# EAGLE design edges_v01 (EAGLE 5.09)

## Sheet 1 of 3
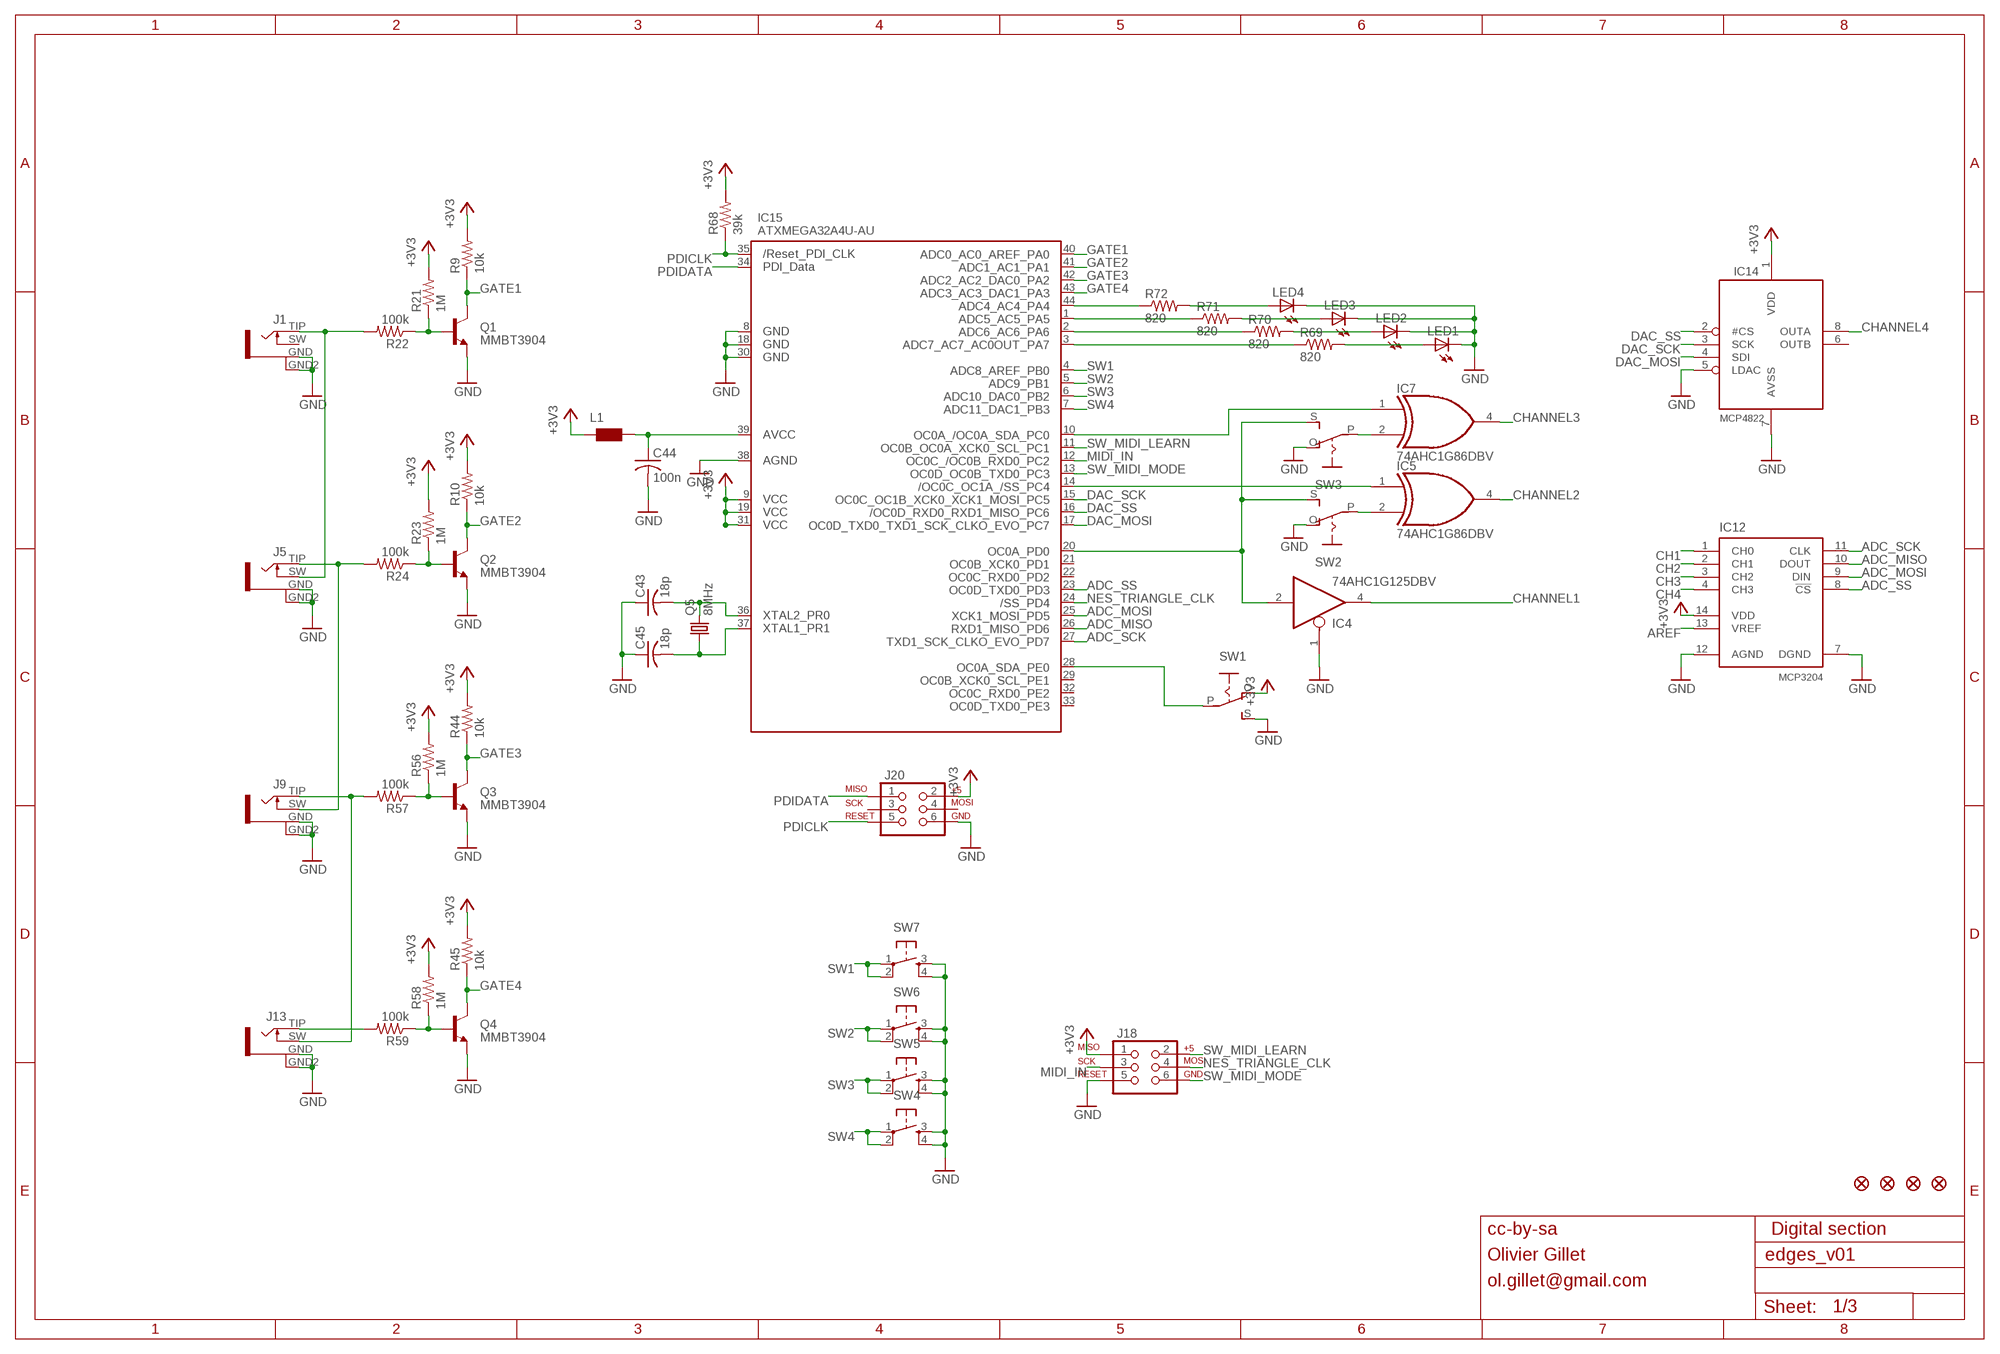
[diagram p0: schematic, sheet 1]

### Parts
C43  18p  C-USC0603  [C0603]
C44  100n  C-USC0603  [C0603]
C45  18p  C-USC0603  [C0603]
IC4  74AHC1G125DBV  [SOT23-5]
IC5  74AHC1G86DBV  [SOT23-5]
IC7  74AHC1G86DBV  [SOT23-5]
IC12  MCP3204  MCP3302  [SO14]
IC14  MCP4822  MCP4822SO08  [SO08]
IC15  ATXMEGA32A4U-AU  AVR_XMEGA_A4_44A  [TQFP44]
J1  PJ301WQP  [WQP_PJ_301BM]
J5  PJ301WQP  [WQP_PJ_301BM]
J9  PJ301WQP  [WQP_PJ_301BM]
J13  PJ301WQP  [WQP_PJ_301BM]
J18  AVR_SPI_PRG_6PTH  [2X3]
J20  AVR_SPI_PRG_6PTH  [2X3]
JP1  FIDUCIAL1X2  [FIDUCIAL-1X2]
JP2  FIDUCIAL1X2  [FIDUCIAL-1X2]
JP3  FIDUCIAL1X2  [FIDUCIAL-1X2]
JP4  FIDUCIAL1X2  [FIDUCIAL-1X2]
L1  WE-CBF_0603  [0603]
LED1  LED3MM  [LED3MM]
LED2  LED3MM  [LED3MM]
LED3  LED3MM  [LED3MM]
LED4  LED3MM  [LED3MM]
Q1  MMBT3904  MMBT3904LT1-NPN-SOT23-BEC  [SOT23-BEC]
Q2  MMBT3904  MMBT3904LT1-NPN-SOT23-BEC  [SOT23-BEC]
Q3  MMBT3904  MMBT3904LT1-NPN-SOT23-BEC  [SOT23-BEC]
Q4  MMBT3904  MMBT3904LT1-NPN-SOT23-BEC  [SOT23-BEC]
Q5  8MHz  CRYSTALHC49U70  [HC49U70]
R9  10k  R-US_R0603  [R0603]
R10  10k  R-US_R0603  [R0603]
R21  1M  R-US_R0603  [R0603]
R22  100k  R-US_R0603  [R0603]
R23  1M  R-US_R0603  [R0603]
R24  100k  R-US_R0603  [R0603]
R44  10k  R-US_R0603  [R0603]
R45  10k  R-US_R0603  [R0603]
R56  1M  R-US_R0603  [R0603]
R57  100k  R-US_R0603  [R0603]
R58  1M  R-US_R0603  [R0603]
R59  100k  R-US_R0603  [R0603]
R68  39k  R-US_R0603  [R0603]
R69  820  R-US_R0603  [R0603]
R70  820  R-US_R0603  [R0603]
R71  820  R-US_R0603  [R0603]
R72  820  R-US_R0603  [R0603]
SW1  S-ON-ONSMALL_SLIDE  [ES_100SP1T6B11M2QEH_SMALL]
SW2  S-ON-ONSMALL_SLIDE  [ES_100SP1T6B11M2QEH_SMALL]
SW3  S-ON-ONSMALL_SLIDE  [ES_100SP1T6B11M2QEH_SMALL]
SW4  TAC_SWITCHPTH  [TACTILE-PTH]
SW5  TAC_SWITCHPTH  [TACTILE-PTH]
SW6  TAC_SWITCHPTH  [TACTILE-PTH]
SW7  TAC_SWITCHPTH  [TACTILE-PTH]

### Nets
+3V3: IC12.14(VDD) IC14.1(VDD) IC15.9(VCC1) IC15.19(VCC2) IC15.31(VCC3) J18.1 J20.2 L1.1 R9.2 R10.2 R21.2 R23.2 R44.2 R45.2 R56.2 R58.2 R68.2 SW1.O ; also sheet 3
ADC_MISO: IC12.10(DOUT) IC15.26(PD6)
ADC_MOSI: IC12.9(DIN) IC15.25(PD5)
ADC_SCK: IC12.11(CLK) IC15.27(PD7)
ADC_SS: IC12.8(!CS) IC15.23(PD3)
AREF: IC12.13(VREF) ; also sheet 3
CH1: IC12.1(CH0) ; also sheet 2
CH2: IC12.2(CH1) ; also sheet 2
CH3: IC12.3(CH2) ; also sheet 2
CH4: IC12.4(CH3) ; also sheet 2
CHANNEL1: IC4.4(O) ; also sheet 2
CHANNEL2: IC5.4(O) ; also sheet 2
CHANNEL3: IC7.4(O) ; also sheet 2
CHANNEL4: IC14.8(OUTA) ; also sheet 2
DAC_MOSI: IC14.4(SDI) IC15.17(PC7)
DAC_SCK: IC14.3(SCK) IC15.15(PC5)
DAC_SS: IC14.2(#CS) IC15.16(PC6)
GATE1: IC15.40(PA0) Q1.C R9.1
GATE1_IN: J1.TIP J5.SW R22.2
GATE1_LED: LED4.A R72.2
GATE2: IC15.41(PA1) Q2.C R10.1
GATE2_IN: J5.TIP J9.SW R24.2
GATE2_LED: LED3.A R71.2
GATE3: IC15.42(PA2) Q3.C R44.1
GATE3_IN: J9.TIP J13.SW R57.2
GATE3_LED: LED2.A R70.2
GATE4: IC15.43(PA3) Q4.C R45.1
GATE4_IN: J13.TIP R59.2
GATE4_LED: LED1.A R69.2
GND: C43.1 C44.2 C45.1 IC4.1(OE) IC12.7(DGND) IC12.12(AGND) IC14.5(LDAC) IC14.7(AVSS) IC15.8(GND1) IC15.18(GND2) IC15.30(GND3) IC15.38(AGND) J1.GND J1.GND2 J5.GND J5.GND2 J9.GND J9.GND2 J13.GND J13.GND2 J18.5 J20.6 LED1.K(C) LED2.K(C) LED3.K(C) LED4.K(C) Q1.E Q2.E Q3.E Q4.E SW1.S SW2.O SW3.O SW4.3 SW4.4 SW5.3 SW5.4 SW6.3 SW6.4 SW7.3 SW7.4 ; also sheet 2,3
MIDI_IN: IC15.12(PC2) J18.3
N$1: Q1.B R21.1 R22.1
N$2: Q2.B R23.1 R24.1
N$3: Q3.B R56.1 R57.1
N$5: IC15.44(PA4) R72.1
N$6: IC15.1(PA5) R71.1
N$7: IC15.2(PA6) R70.1
N$8: IC15.3(PA7) R69.1
N$19: IC5.1(I0) IC15.14(PC4)
N$21: IC7.2(I1) SW3.P
N$24: IC5.2(I1) SW2.P
N$39: C44.1 IC15.39(AVCC) L1.2
N$41: IC7.1(I0) IC15.10(PC0)
N$48: IC4.2(I) IC15.20(PD0) SW2.S SW3.S
N$82: C45.2 IC15.37(PR1) Q5.1
N$83: C43.2 IC15.36(PR0) Q5.2
N$40000: Q4.B R58.1 R59.1
NES_TRIANGLE_CLK: IC15.24(PD4) J18.4
PDICLK: IC15.35(RESET) J20.5 R68.1
PDIDATA: IC15.34(PDI_DATA) J20.1
SW1: IC15.4(PB0) SW7.1 SW7.2
SW2: IC15.5(PB1) SW6.1 SW6.2
SW3: IC15.6(PB2) SW5.1 SW5.2
SW4: IC15.7(PB3) SW4.1 SW4.2
SW_MIDI_LEARN: IC15.11(PC1) J18.2
SW_MIDI_MODE: IC15.13(PC3) J18.6
SYNC_SWITCH: IC15.28(PE0) SW1.P
Unconnected: IC14.6(OUTB) IC15.21(PD1) IC15.22(PD2) IC15.29(PE1) IC15.32(PE2) IC15.33(PE3) J1.SW J20.3 J20.4

### Notes on the sheet
- cc-by-sa | Digital section
- Olivier Gillet
- ol.gillet@gmail.com

## Sheet 2 of 3
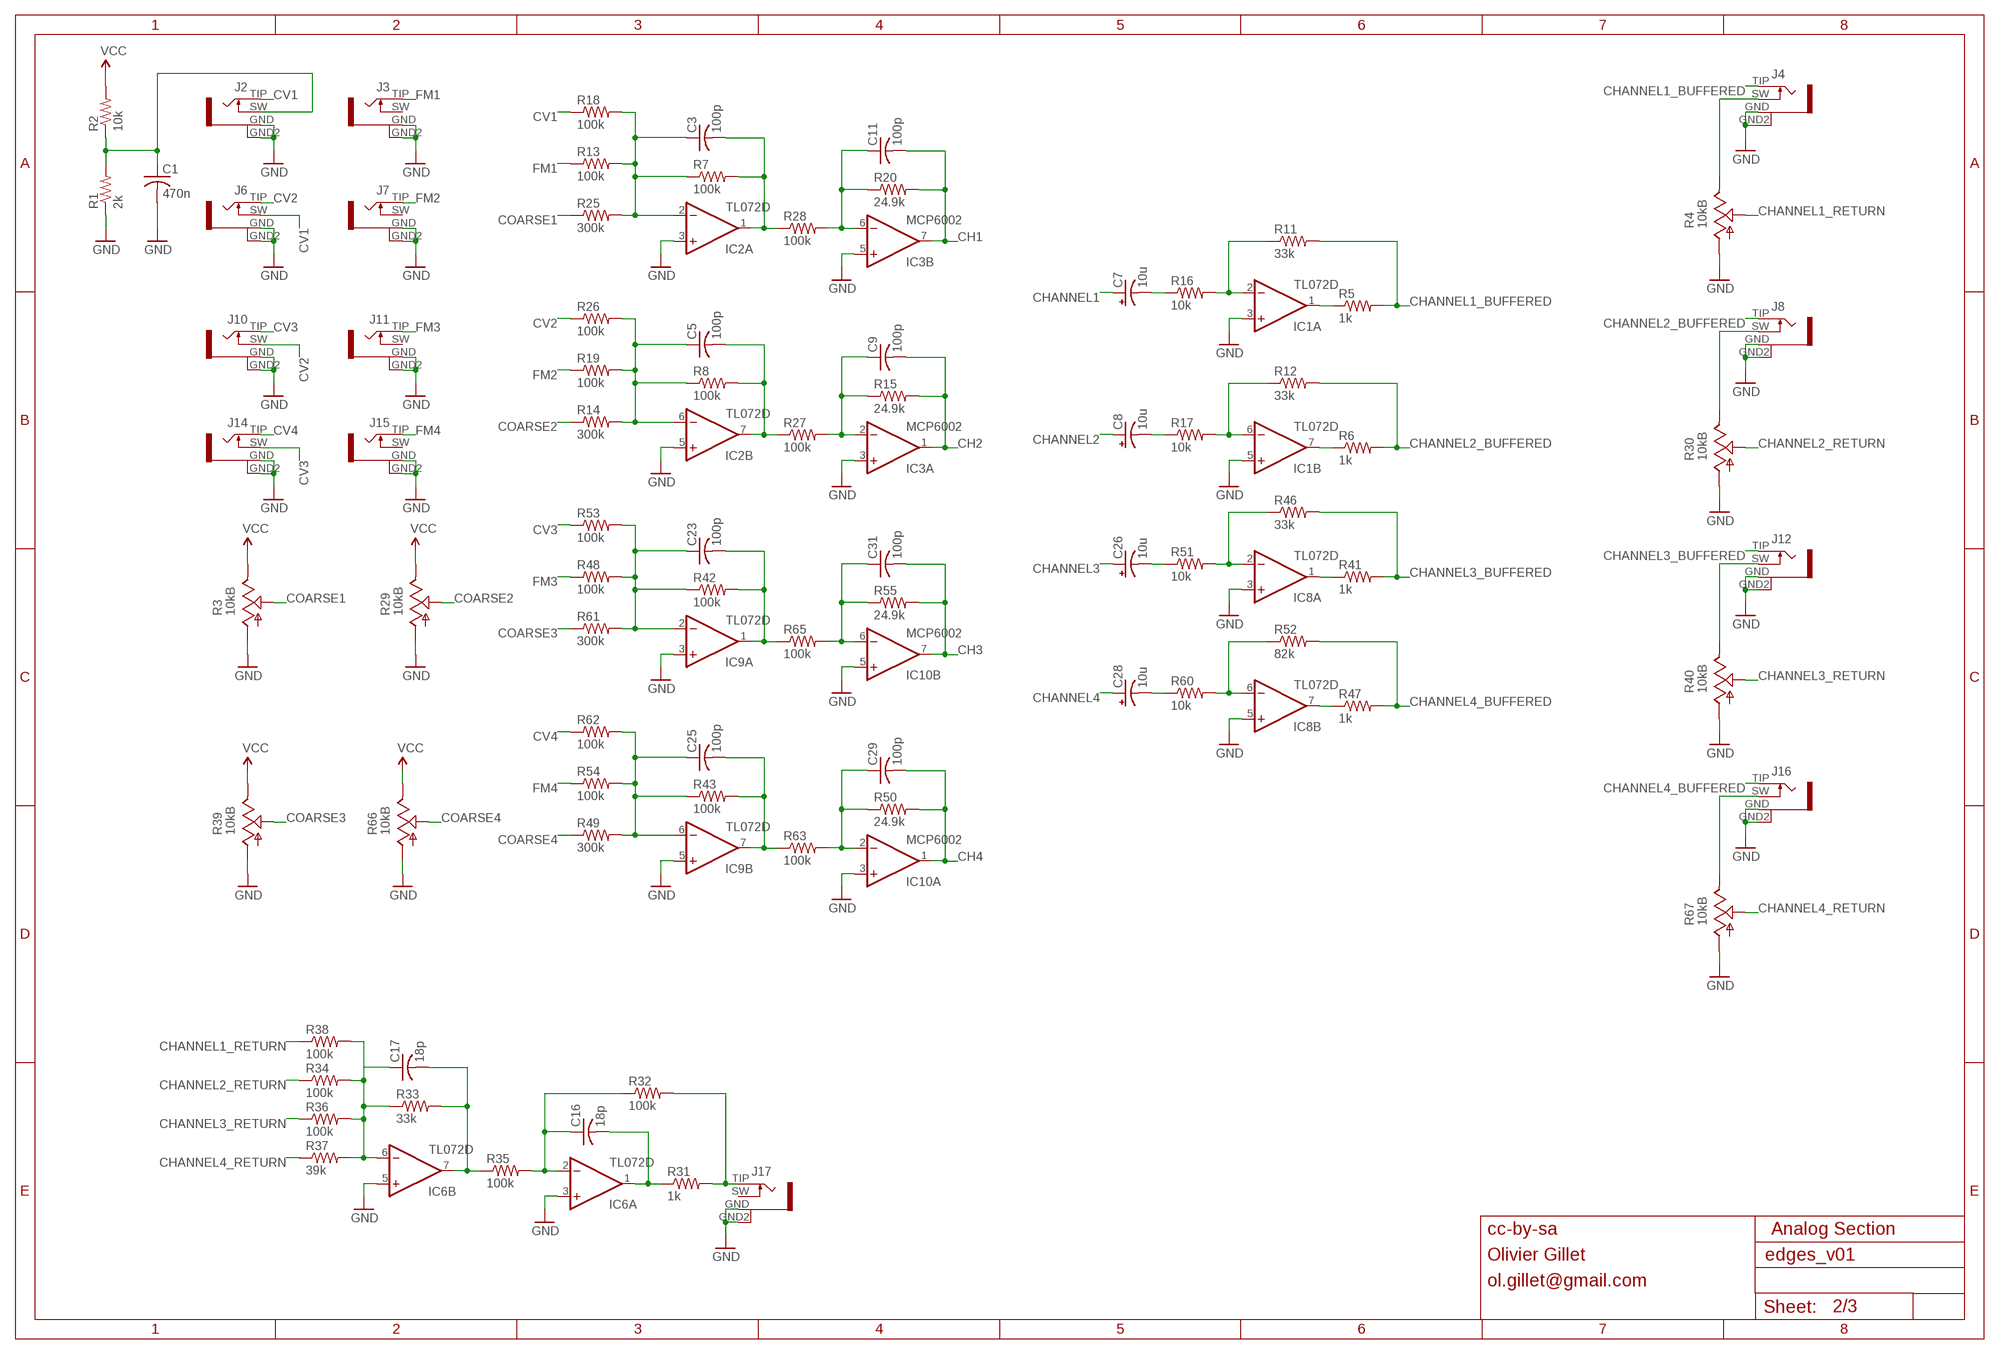
[diagram p1: schematic, sheet 2]

### Parts
C1  470n  C-USC0603  [C0603]
C3  100p  C-USC0603  [C0603]
C5  100p  C-USC0603  [C0603]
C7  10u  CPOL-USC  [PANASONIC_C]
C8  10u  CPOL-USC  [PANASONIC_C]
C9  100p  C-USC0603  [C0603]
C11  100p  C-USC0603  [C0603]
C16  18p  C-USC0603  [C0603]
C17  18p  C-USC0603  [C0603]
C23  100p  C-USC0603  [C0603]
C25  100p  C-USC0603  [C0603]
C26  10u  CPOL-USC  [PANASONIC_C]
C28  10u  CPOL-USC  [PANASONIC_C]
C29  100p  C-USC0603  [C0603]
C31  100p  C-USC0603  [C0603]
IC1  TL072D  [SO08]
IC2  TL072D  [SO08]
IC3  MCP6002  TL072D  [SO08]
IC6  TL072D  [SO08]
IC8  TL072D  [SO08]
IC9  TL072D  [SO08]
IC10  MCP6002  TL072D  [SO08]
J2  PJ301WQP  [WQP_PJ_301BM]
J3  PJ301WQP  [WQP_PJ_301BM]
J4  PJ301WQP  [WQP_PJ_301BM]
J6  PJ301WQP  [WQP_PJ_301BM]
J7  PJ301WQP  [WQP_PJ_301BM]
J8  PJ301WQP  [WQP_PJ_301BM]
J10  PJ301WQP  [WQP_PJ_301BM]
J11  PJ301WQP  [WQP_PJ_301BM]
J12  PJ301WQP  [WQP_PJ_301BM]
J14  PJ301WQP  [WQP_PJ_301BM]
J15  PJ301WQP  [WQP_PJ_301BM]
J16  PJ301WQP  [WQP_PJ_301BM]
J17  PJ301WQP  [WQP_PJ_301BM]
R1  2k  R-US_R0603  [R0603]
R2  10k  R-US_R0603  [R0603]
R3  10kB  POT_USVERTICAL_PS  [ALPS_POT_VERTICAL_PS]
R4  10kB  POT_USVERTICAL_PS  [ALPS_POT_VERTICAL_PS]
R5  1k  R-US_R0603  [R0603]
R6  1k  R-US_R0603  [R0603]
R7  100k  R-US_R0603  [R0603]
R8  100k  R-US_R0603  [R0603]
R11  33k  R-US_R0603  [R0603]
R12  33k  R-US_R0603  [R0603]
R13  100k  R-US_R0603  [R0603]
R14  300k  R-US_R0603  [R0603]
R15  24.9k  R-US_R0603  [R0603]
R16  10k  R-US_R0603  [R0603]
R17  10k  R-US_R0603  [R0603]
R18  100k  R-US_R0603  [R0603]
R19  100k  R-US_R0603  [R0603]
R20  24.9k  R-US_R0603  [R0603]
R25  300k  R-US_R0603  [R0603]
R26  100k  R-US_R0603  [R0603]
R27  100k  R-US_R0603  [R0603]
R28  100k  R-US_R0603  [R0603]
R29  10kB  POT_USVERTICAL_PS  [ALPS_POT_VERTICAL_PS]
R30  10kB  POT_USVERTICAL_PS  [ALPS_POT_VERTICAL_PS]
R31  1k  R-US_R0603  [R0603]
R32  100k  R-US_R0603  [R0603]
R33  33k  R-US_R0603  [R0603]
R34  100k  R-US_R0603  [R0603]
R35  100k  R-US_R0603  [R0603]
R36  100k  R-US_R0603  [R0603]
R37  39k  R-US_R0603  [R0603]
R38  100k  R-US_R0603  [R0603]
R39  10kB  POT_USVERTICAL_PS  [ALPS_POT_VERTICAL_PS]
R40  10kB  POT_USVERTICAL_PS  [ALPS_POT_VERTICAL_PS]
R41  1k  R-US_R0603  [R0603]
R42  100k  R-US_R0603  [R0603]
R43  100k  R-US_R0603  [R0603]
R46  33k  R-US_R0603  [R0603]
R47  1k  R-US_R0603  [R0603]
R48  100k  R-US_R0603  [R0603]
R49  300k  R-US_R0603  [R0603]
R50  24.9k  R-US_R0603  [R0603]
R51  10k  R-US_R0603  [R0603]
R52  82k  R-US_R0603  [R0603]
R53  100k  R-US_R0603  [R0603]
R54  100k  R-US_R0603  [R0603]
R55  24.9k  R-US_R0603  [R0603]
R60  10k  R-US_R0603  [R0603]
R61  300k  R-US_R0603  [R0603]
R62  100k  R-US_R0603  [R0603]
R63  100k  R-US_R0603  [R0603]
R65  100k  R-US_R0603  [R0603]
R66  10kB  POT_USVERTICAL_PS  [ALPS_POT_VERTICAL_PS]
R67  10kB  POT_USVERTICAL_PS  [ALPS_POT_VERTICAL_PS]

### Nets
CH1: C11.2 IC3.7(B:OUT) R20.2 ; also sheet 1
CH2: C9.2 IC3.1(A:OUT) R15.2 ; also sheet 1
CH3: C31.2 IC10.7(B:OUT) R55.2 ; also sheet 1
CH4: C29.2 IC10.1(A:OUT) R50.2 ; also sheet 1
CHANNEL1: C7.+ ; also sheet 1
CHANNEL1_BUFFERED: J4.TIP R5.2 R11.2
CHANNEL1_RETURN: R4.P$2(S) R38.1
CHANNEL2: C8.+ ; also sheet 1
CHANNEL2_BUFFERED: J8.TIP R6.2 R12.2
CHANNEL2_RETURN: R30.P$2(S) R34.1
CHANNEL3: C26.+ ; also sheet 1
CHANNEL3_BUFFERED: J12.TIP R41.2 R46.2
CHANNEL3_RETURN: R36.1 R40.P$2(S)
CHANNEL4: C28.+ ; also sheet 1
CHANNEL4_BUFFERED: J16.TIP R47.2 R52.2
CHANNEL4_RETURN: R37.1 R67.P$2(S)
COARSE1: R3.P$2(S) R25.1
COARSE2: R14.1 R29.P$2(S)
COARSE3: R39.P$2(S) R61.1
COARSE4: R49.1 R66.P$2(S)
CV1: J2.TIP J6.SW R18.1
CV2: J6.TIP J10.SW R26.1
CV3: J10.TIP J14.SW R53.1
CV4: J14.TIP R62.1
FM1: J3.TIP R13.1
FM2: J7.TIP R19.1
FM3: J11.TIP R48.1
FM4: J15.TIP R54.1
GND: C1.2 IC1.3(A:+IN) IC1.5(B:+IN) IC2.3(A:+IN) IC2.5(B:+IN) IC3.3(A:+IN) IC3.5(B:+IN) IC6.3(A:+IN) IC6.5(B:+IN) IC8.3(A:+IN) IC8.5(B:+IN) IC9.3(A:+IN) IC9.5(B:+IN) IC10.3(A:+IN) IC10.5(B:+IN) J2.GND J2.GND2 J3.GND J3.GND2 J4.GND J4.GND2 J6.GND J6.GND2 J7.GND J7.GND2 J8.GND J8.GND2 J10.GND J10.GND2 J11.GND J11.GND2 J12.GND J12.GND2 J14.GND J14.GND2 J15.GND J15.GND2 J16.GND J16.GND2 J17.GND J17.GND2 R1.1 R3.P$3(A) R4.P$3(A) R29.P$3(A) R30.P$3(A) R39.P$3(A) R40.P$3(A) R66.P$3(A) R67.P$3(A) ; also sheet 1,3
N$4: J8.SW R30.P$1(E)
N$9: C5.1 IC2.6(B:-IN) R8.1 R14.2 R19.2 R26.2
N$10: C5.2 IC2.7(B:OUT) R8.2 R27.1
N$11: C9.1 IC3.2(A:-IN) R15.1 R27.2
N$12: C3.2 IC2.1(A:OUT) R7.2 R28.1
N$13: C23.1 IC9.2(A:-IN) R42.1 R48.2 R53.2 R61.2
N$14: C23.2 IC9.1(A:OUT) R42.2 R65.1
N$15: C31.1 IC10.6(B:-IN) R55.1 R65.2
N$16: C25.1 IC9.6(B:-IN) R43.1 R49.2 R54.2 R62.2
N$17: C25.2 IC9.7(B:OUT) R43.2 R63.1
N$18: C29.1 IC10.2(A:-IN) R50.1 R63.2
N$20: C7.- R16.1
N$22: IC1.2(A:-IN) R11.1 R16.2
N$23: IC1.1(A:OUT) R5.1
N$25: C8.- R17.1
N$26: IC1.6(B:-IN) R12.1 R17.2
N$27: IC1.7(B:OUT) R6.1
N$28: C26.- R51.1
N$29: C11.1 IC3.6(B:-IN) R20.1 R28.2
N$30: IC8.2(A:-IN) R46.1 R51.2
N$31: IC8.1(A:OUT) R41.1
N$32: C28.- R60.1
N$33: IC8.6(B:-IN) R52.1 R60.2
N$34: IC8.7(B:OUT) R47.1
N$35: C17.1 IC6.6(B:-IN) R33.1 R34.2 R36.2 R37.2 R38.2
N$36: C16.1 IC6.2(A:-IN) R32.1 R35.2
N$37: C16.2 IC6.1(A:OUT) R31.1
N$40: J4.SW R4.P$1(E)
N$42: C17.2 IC6.7(B:OUT) R33.2 R35.1
N$43: J12.SW R40.P$1(E)
N$44: J16.SW R67.P$1(E)
N$45: C3.1 IC2.2(A:-IN) R7.1 R13.2 R18.2 R25.2
N$46: C1.1 J2.SW R1.2 R2.1
N$50: J17.TIP R31.2 R32.2
VCC: R2.2 R3.P$1(E) R29.P$1(E) R39.P$1(E) R66.P$1(E) ; also sheet 3
Unconnected: J3.SW J7.SW J11.SW J15.SW J17.SW

### Notes on the sheet
- cc-by-sa | Analog Section
- Olivier Gillet
- ol.gillet@gmail.com

## Sheet 3 of 3
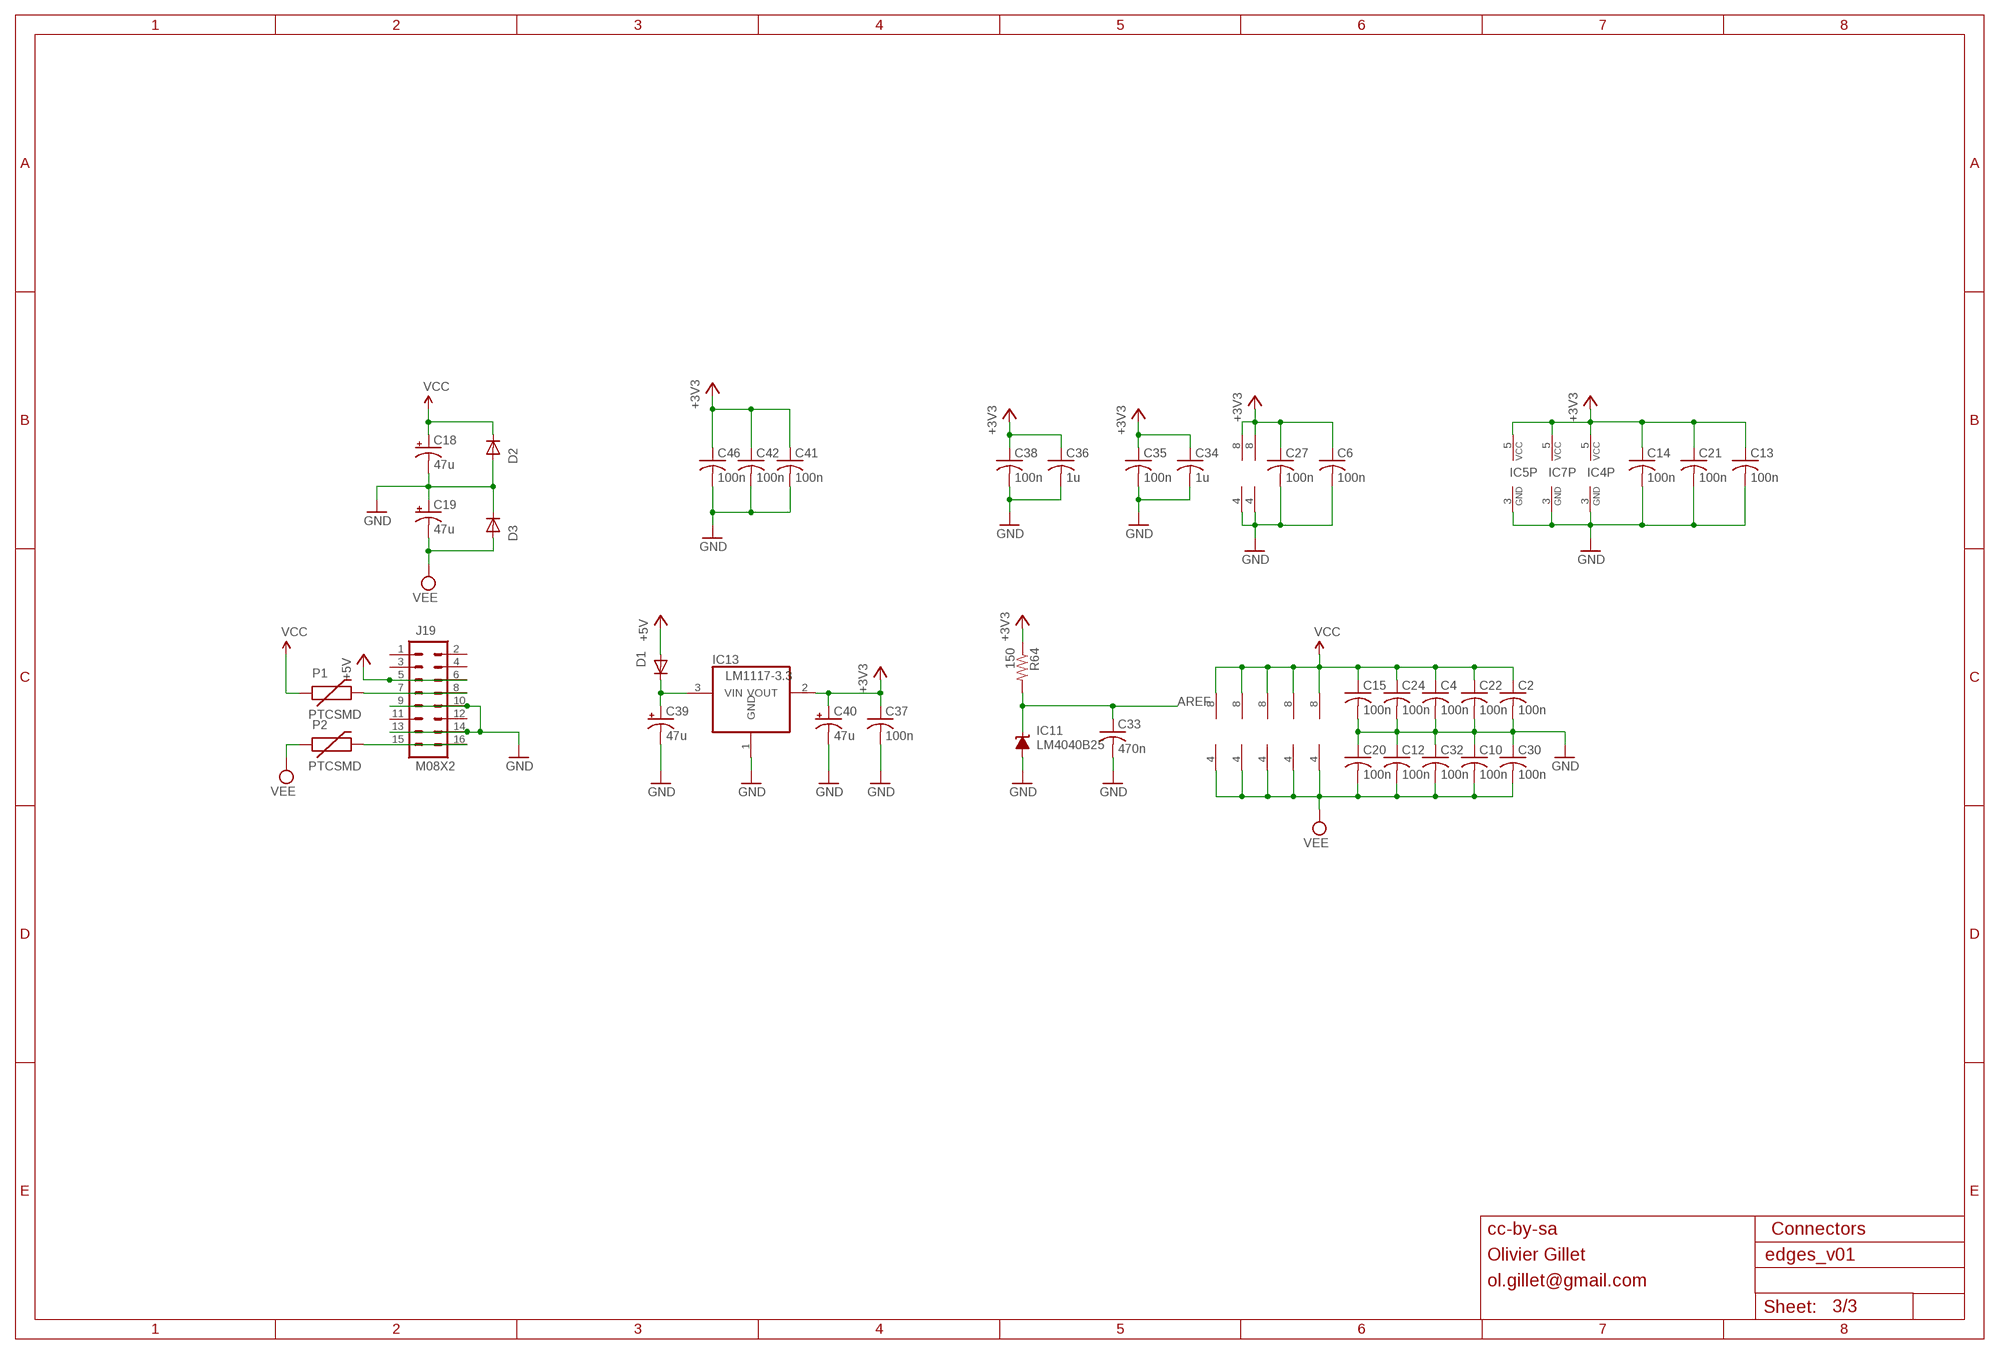
[diagram p2: schematic, sheet 3]

### Parts
C2  100n  C-USC0603  [C0603]
C4  100n  C-USC0603  [C0603]
C6  100n  C-USC0603  [C0603]
C10  100n  C-USC0603  [C0603]
C12  100n  C-USC0603  [C0603]
C13  100n  C-USC0603  [C0603]
C14  100n  C-USC0603  [C0603]
C15  100n  C-USC0603  [C0603]
C18  47u  CPOL-USD  [PANASONIC_D]
C19  47u  CPOL-USD  [PANASONIC_D]
C20  100n  C-USC0603  [C0603]
C21  100n  C-USC0603  [C0603]
C22  100n  C-USC0603  [C0603]
C24  100n  C-USC0603  [C0603]
C27  100n  C-USC0603  [C0603]
C30  100n  C-USC0603  [C0603]
C32  100n  C-USC0603  [C0603]
C33  470n  C-USC0603  [C0603]
C34  1u  C-USC0603  [C0603]
C35  100n  C-USC0603  [C0603]
C36  1u  C-USC0603  [C0603]
C37  100n  C-USC0603  [C0603]
C38  100n  C-USC0603  [C0603]
C39  47u  CPOL-USD  [PANASONIC_D]
C40  47u  CPOL-USD  [PANASONIC_D]
C41  100n  C-USC0603  [C0603]
C42  100n  C-USC0603  [C0603]
C46  100n  C-USC0603  [C0603]
D1  1N5819HW  DIODE-SOD123  [SOD123]
D2  1N5819HW  DIODE-SOD123  [SOD123]
D3  1N5819HW  DIODE-SOD123  [SOD123]
IC11  LM4040B25  LM4041B12DBZ  [DBZ_R-PDSO-G3]
IC13  LM1117-3.3  REG1117  [SOT223]
J19  M08X2  [2X8]
P1  PTCSMD  [PTC-1206]
P2  PTCSMD  [PTC-1206]
R64  150  R-US_R0603  [R0603]

### Nets
+3V3: C6.1 C13.1 C14.1 C21.1 C27.1 C34.1 C35.1 C36.1 C37.1 C38.1 C40.+ C41.1 C42.1 C46.1 IC3.8(P:V+) IC4.5(VCC) IC5.5(VCC) IC7.5(VCC) IC10.8(P:V+) IC13.2(VOUT) R64.1 ; also sheet 1
+5V: D1.A J19.5 J19.6
AREF: C33.1 IC11.1(C) R64.2 ; also sheet 1
GND: C2.2 C4.2 C6.2 C10.1 C12.1 C13.2 C14.2 C15.2 C18.- C19.+ C20.1 C21.2 C22.2 C24.2 C27.2 C30.1 C32.1 C33.2 C34.2 C35.2 C36.2 C37.2 C38.2 C39.- C40.- C41.2 C42.2 C46.2 D2.A D3.C IC3.4(P:V-) IC4.3(GND) IC5.3(GND) IC7.3(GND) IC10.4(P:V-) IC11.2(A) IC13.1(GND) J19.9 J19.10 J19.13 J19.14 ; also sheet 1,2
N$38: C39.+ D1.C IC13.3(VIN)
N$47: J19.7 J19.8 P1.2
N$49: J19.15 J19.16 P2.2
VCC: C2.1 C4.1 C15.1 C18.+ C22.1 C24.1 D2.C IC1.8(P:V+) IC2.8(P:V+) IC6.8(P:V+) IC8.8(P:V+) IC9.8(P:V+) P1.1 ; also sheet 2
VEE: C10.2 C12.2 C19.- C20.2 C30.2 C32.2 D3.A IC1.4(P:V-) IC2.4(P:V-) IC6.4(P:V-) IC8.4(P:V-) IC9.4(P:V-) P2.1
Unconnected: J19.1 J19.2 J19.3 J19.4 J19.11 J19.12

### Notes on the sheet
- cc-by-sa | Connectors
- Olivier Gillet
- ol.gillet@gmail.com

## Library data of the parts
C1-C6 C9-C17 C20-C25 C27 C29-C38 C41-C46 = rcl:C-US: CAPACITOR, American symbol
C7 C8 C18 C19 C26 C28 C39 C40 = rcl:CPOL-US: POLARIZED CAPACITOR, American symbol
D1-D3 = diode:DIODE-: DIODE
IC1-IC3 IC6 IC8-IC10 = og-linear:TL072: OP AMP
IC4 = 74xx-little-us:74*1G125: Single Bus Buffer Gate with 3-State Output
IC5 IC7 = 74xx-little-us:74*1G86: 2-input EXCLUSIV-OR gate
IC11 = texas:LM4041: PRECISION MICROPOWER SHUNT VOLTAGE REFERENCE Source: http://focus.ti.com/lit/ds/slcs146e/slcs146e.pdf
IC12 = og-adc:MCP3302
IC13 = og-vreg:REG1117: 800mA and 1A Low Dropout (LDO) Positive Regulator 1.8V, 2.5V, 2.85V, 3.3V, 5V, and Adj
IC14 = og-dac:MCP4822
IC15 = xmega:AVR_XMEGA_A4_: Device for Atmel AVR XMEGA A4 Series
J1-J17 = og-pj301:PJ301
J18 J20 = SparkFun:AVR_SPI_PRG_6: AVR ISP 6 Pin This is the reduced ISP connector for AVR programming. Common on Arduino. This footprint will take up less PCB space and can be used with a 10-pin to 6-pin adapter such as SKU: BOB-08508
J19 = og-header:M08X2
JP1-JP4 = SparkFun:FIDUCIAL: Fiducial Alignment Points Various fiducial points for machine vision alignment.
L1 = wuerth-elektronik:WE-CBF: SMD EMI Suppression Ferrite Beads - excellent anti-EMI properties - low DCR - impedances till 3000 ohms - rated current up to 6 A
LED1-LED4 = led:LED: LED OSRAM: - CHIPLED LG R971, LG N971, LY N971, LG Q971, LY Q971, LO R971, LY R971 LH N974, LH R974 LS Q976, LO Q976, LY Q976 LO Q996 - Hyper CHIPLED LW Q18S LB Q993, LB Q99A, LB R99A - SideLED LS A670, LO A670, LY A670, LG A670, LP A670 LB A673, LV A673, LT A673, LW A673 LH A674 LY A675 LS A676, LA A676, LO A676, LY A676, LW A676 LS A679, LY A679, LG A679 - Hyper Micro SIDELED® LS Y876, LA Y876, LO Y876, LY Y876 LT Y87S - SmartLED LW L88C, LW L88S LB L89C, LB L89S, LG L890 LS L89K, LO L89K, LY L89K LS L896, LA L896, LO L896, LY L896 - TOPLED LS T670, LO T670, LY T670, LG T670, LP T670 LSG T670, LSP T670, LSY T670, LOP T670, LYG T670 LG T671, LOG T671, LSG T671 LB T673, LV T673, LT T673, LW T673 LH T674 LS T676, LA T676, LO T676, LY T676, LB T676, LH T676, LSB T676, LW T676 LB T67C, LV T67C, LT T67C, LS T67K, LO T67K, LY T67K, LW E67C LS E67B, LA E67B, LO E67B, LY E67B, LB E67C, LV E67C, LT E67C LW T67C LS T679, LY T679, LG T679 LS T770, LO T770, LY T770, LG T770, LP T770 LB T773, LV T773, LT T773, LW T773 LH T774 LS E675, LA E675, LY E675, LS T675 LS T776, LA T776, LO T776, LY T776, LB T776 LHGB T686 LT T68C, LB T68C - Hyper Mini TOPLED® LB M676 - Mini TOPLED Santana® LG M470 LS M47K, LO M47K, LY M47K Source: http://www.osram.convergy.de LUXEON: - LUMILED® LXK2-PW12-R00, LXK2-PW12-S00, LXK2-PW14-U00, LXK2-PW14-V00 LXK2-PM12-R00, LXK2-PM12-S00, LXK2-PM14-U00 LXK2-PE12-Q00, LXK2-PE12-R00, LXK2-PE12-S00, LXK2-PE14-T00, LXK2-PE14-U00 LXK2-PB12-K00, LXK2-PB12-L00, LXK2-PB12-M00, LXK2-PB14-N00, LXK2-PB14-P00, LXK2-PB14-Q00 LXK2-PR12-L00, LXK2-PR12-M00, LXK2-PR14-Q00, LXK2-PR14-R00 LXK2-PD12-Q00, LXK2-PD12-R00, LXK2-PD12-S00 LXK2-PH12-R00, LXK2-PH12-S00 LXK2-PL12-P00, LXK2-PL12-Q00, LXK2-PL12-R00 Source: www.luxeon.com KINGBRIGHT: KA-3528ASYC Source: www.kingbright.com
P1 P2 = SparkFun:PTC: Resettable Fuse PTC Resettable Fuse. Spark Fun Electronics SKU : COM-08357
Q1-Q4 = transistor:*-NPN-: NPN Transistror BF959 corrected 2008.03.06
Q5 = crystal:CRYSTAL: CRYSTAL
R1 R2 R5-R28 R31-R38 R41-R65 R68-R72 = rcl:R-US_: RESISTOR, American symbol
R3 R4 R29 R30 R39 R40 R66 R67 = pot-alps:POT_US
SW1-SW3 = og-switch:S-ON-ON: On-on Switch
SW4-SW7 = SparkFun:TAC_SWITCH: Momentary Switch Button commonly used for reset or general input. Spark Fun Electronics SKU : COM-00097

## Board
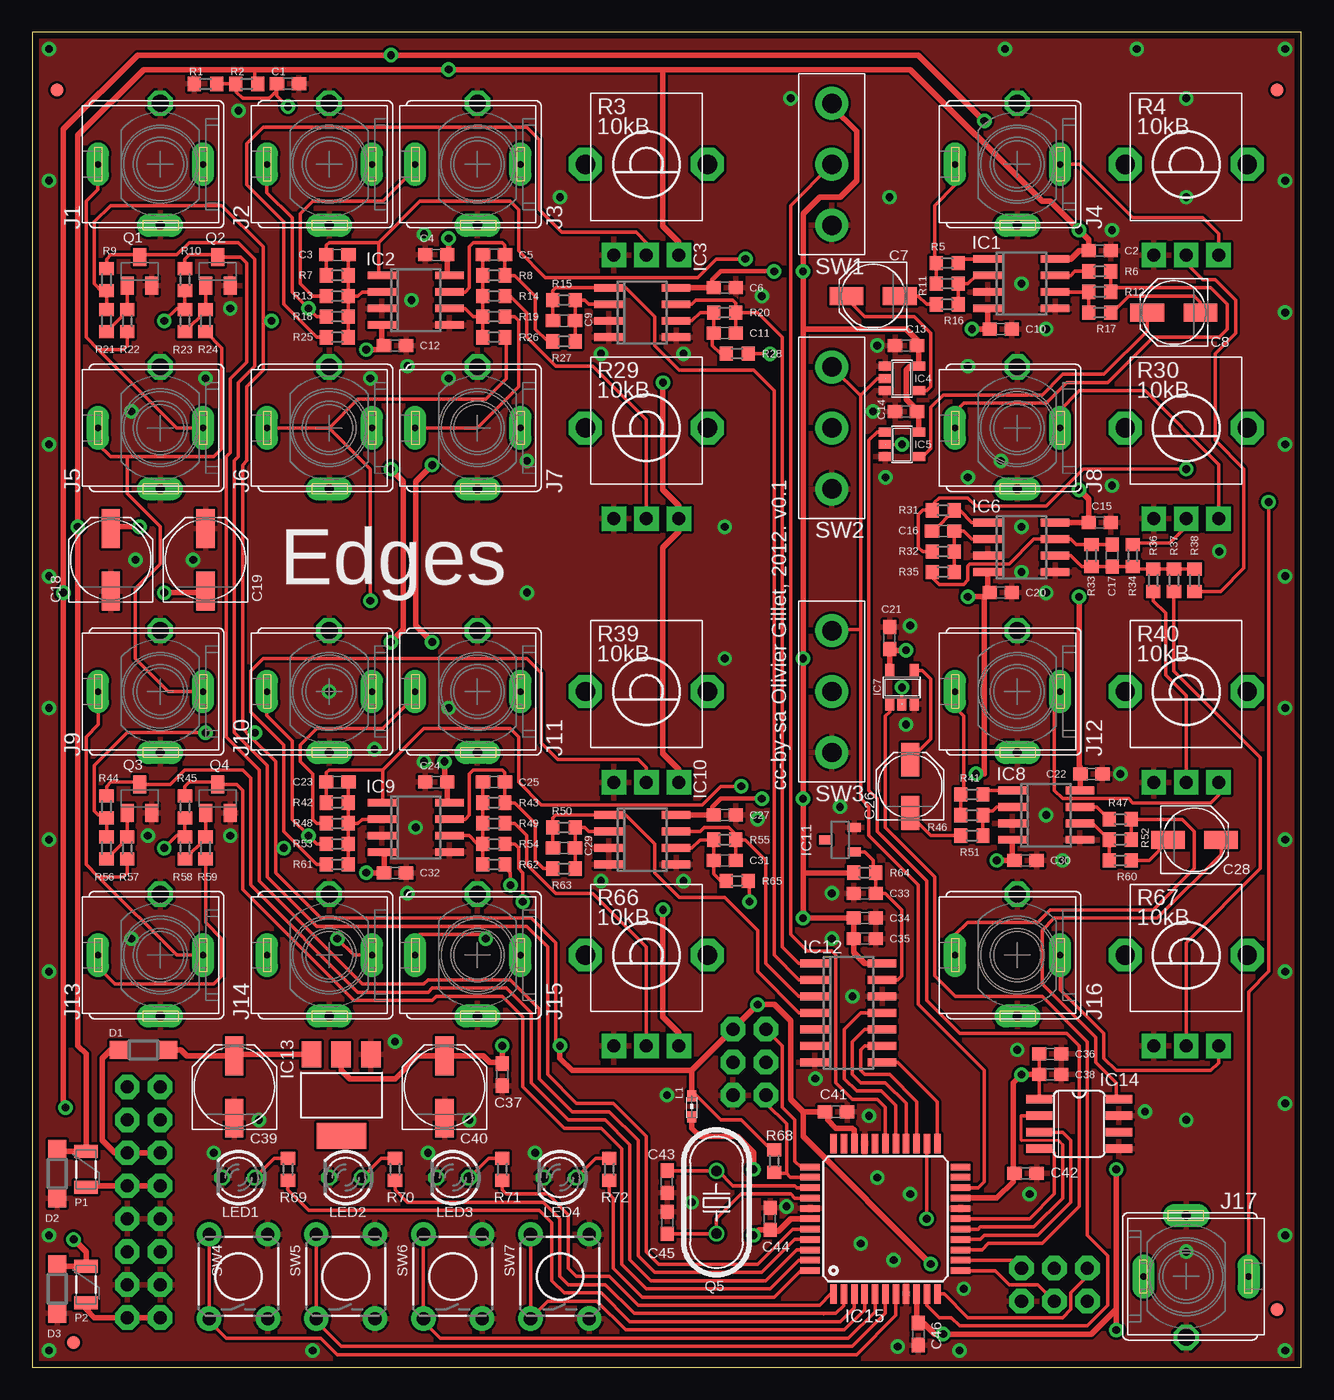
[diagram p3: board, top side]
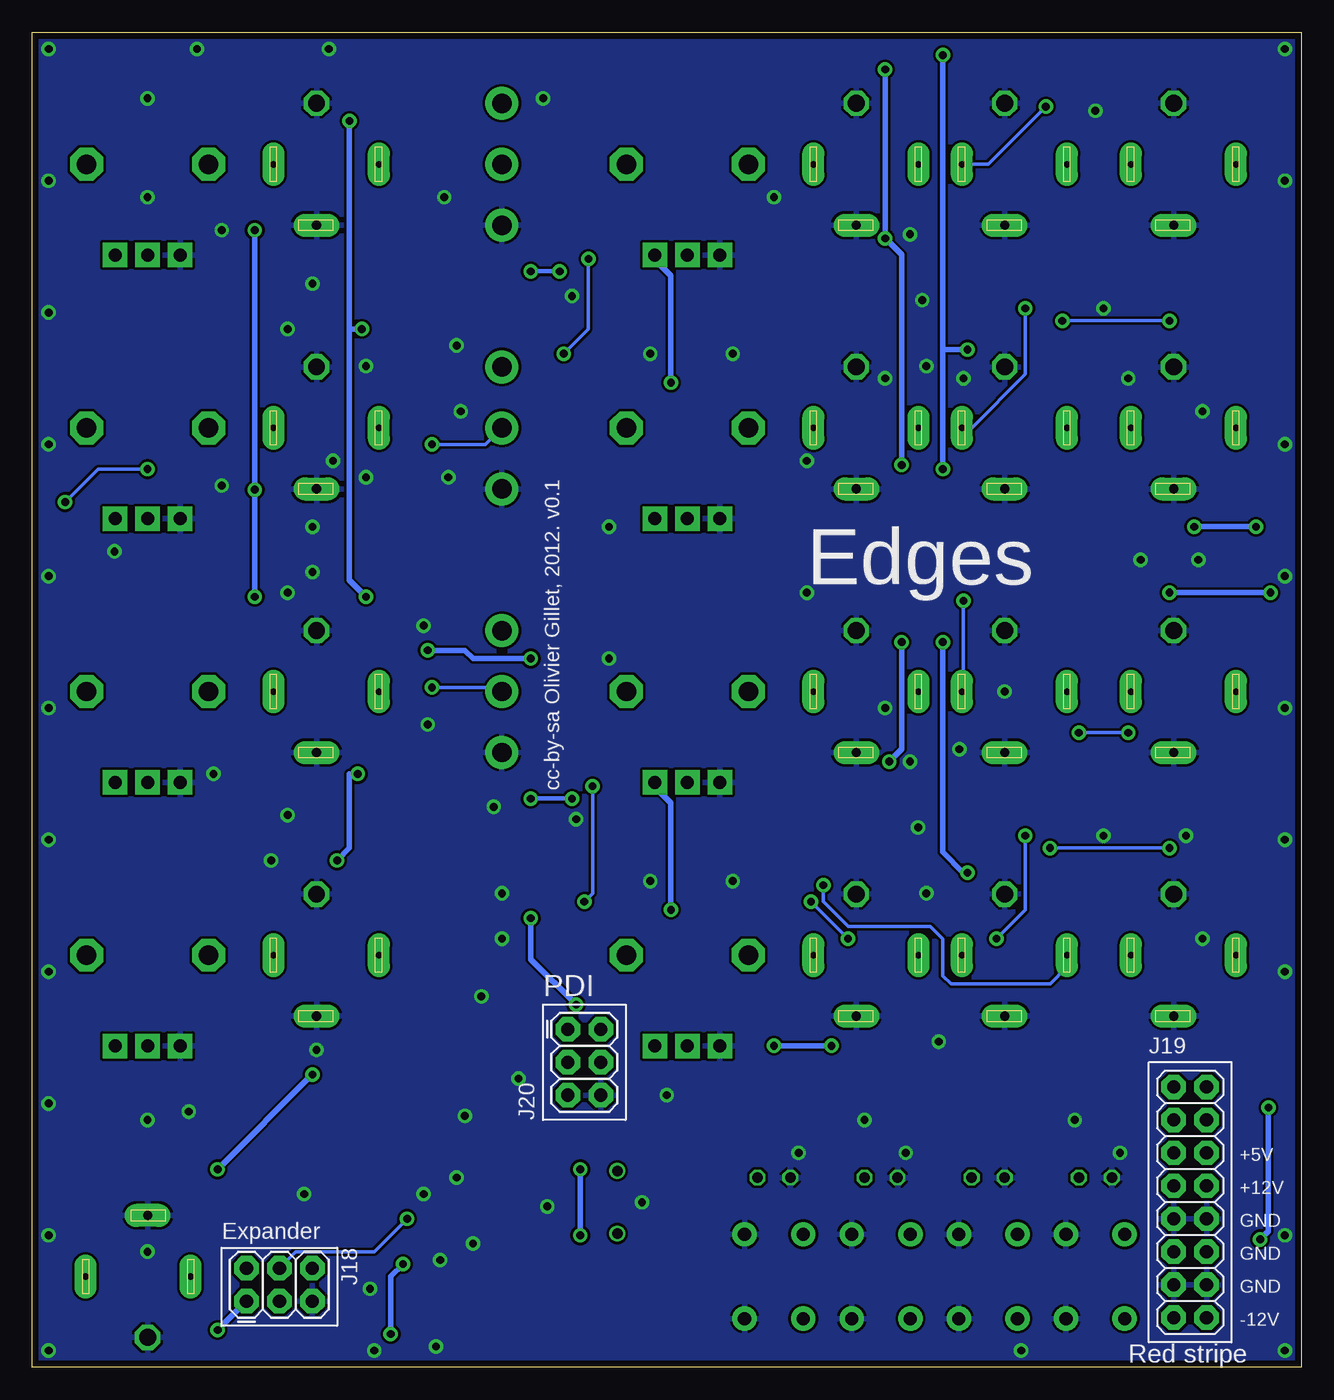
[diagram p4: board, bottom side, seen from below]

Size 97.77 x 102.87 mm. Coordinates in mm from the lower left corner, seen from the top.
Outline: 0,0 97.77,0 97.77,102.87 0,102.87 0,0
Copper layers (1*16): Top 0.035mm / dielectric 1.5mm / Bottom 0.035mm
Design rules "PCBCart-Standard *": minimum track width 8mil, minimum drill 0.4mm, track to track 8mil, track to pad 8mil, pad to pad 8mil, via to via 8mil, smd to smd 8mil, copper to edge 20mil, drill to drill 8mil, minimum pad ring 8mil, minimum via ring 10mil, stop-mask expansion 3mil, vias tented up to drill 25mil, thermal gap 8mil

### Footprints (pad centres in the part's own frame; a part is rotated, then mirrored left to right if it is on the bottom)
C0603 = smd 1.1 x 1: 1 -0.85,0; 2 0.85,0
PANASONIC_C = smd 2.6 x 1.4: + 2.05,0; - -2.05,0
PANASONIC_D = smd 3 x 1.4: + 2.4,0; - -2.4,0
SOD123 = smd 1.4 x 1.4: A 1.9,0; C -1.9,0
SO08 = smd 0.6 x 2.2: 1 -1.905,-2.6; 2 -0.635,-2.6; 3 0.635,-2.6; 4 1.905,-2.6; 5 1.905,2.6; 6 0.635,2.6; 7 -0.635,2.6; 8 -1.905,2.6
SOT23-5 = smd 0.69 x 0.99: 1 -0.95,-1.29; 2 0,-1.29; 3 0.95,-1.29; 4 0.95,1.3; 5 -0.95,1.3
DBZ_R-PDSO-G3 = smd 0.7 x 1: 1 -0.95,-1.1; 2 0.95,-1.1; 3 0,1.1
SO14 = smd 0.6 x 2.2: 1 -3.81,-2.6; 2 -2.54,-2.6; 3 -1.27,-2.6; 4 0,-2.6; 5 1.27,-2.6; 6 2.54,-2.6; 7 3.81,-2.6; 8 3.81,2.6; 9 2.54,2.6; 10 1.27,2.6; 11 0,2.6; 12 -1.27,2.6; 13 -2.54,2.6; 14 -3.81,2.6
SOT223 = smd 1.499 x 2.007: 1 -2.261,-3.15; 2 0.025,-3.15; 3 2.311,-3.15 | smd 3.81 x 2.007: 4 0,3.15
SO08' = smd 0.66 x 2.032: 1 -1.905,-3.073; 2 -0.635,-3.073; 3 0.635,-3.073; 4 1.905,-3.073; 5 1.905,3.073; 6 0.635,3.073; 7 -0.635,3.073; 8 -1.905,3.073
TQFP44 = smd 1.5 x 0.5: 1 -5.8,4; 2 -5.8,3.2; 3 -5.8,2.4; 4 -5.8,1.6; 5 -5.8,0.8; 6 -5.8,0; 7 -5.8,-0.8; 8 -5.8,-1.6; 9 -5.8,-2.4; 10 -5.8,-3.2; 11 -5.8,-4; 23 5.8,-4; 24 5.8,-3.2; 25 5.8,-2.4; 26 5.8,-1.6; 27 5.8,-0.8; 28 5.8,0; 29 5.8,0.8; 30 5.8,1.6; 31 5.8,2.4; 32 5.8,3.2; 33 5.8,4 | smd 0.5 x 1.5: 12 -4,-5.8; 13 -3.2,-5.8; 14 -2.4,-5.8; 15 -1.6,-5.8; 16 -0.8,-5.8; 17 0,-5.8; 18 0.8,-5.8; 19 1.6,-5.8; 20 2.4,-5.8; 21 3.2,-5.8; 22 4,-5.8; 34 4,5.8; 35 3.2,5.8; 36 2.4,5.8; 37 1.6,5.8; 38 0.8,5.8; 39 0,5.8; 40 -0.8,5.8; 41 -1.6,5.8; 42 -2.4,5.8; 43 -3.2,5.8; 44 -4,5.8
WQP_PJ_301BM = drill 0.7 pad 1.778 long: GND -4.7,0 | drill 1.3 octagon: GND2 4.7,0 | drill 0.5 pad 1.676 long: SW 0,-3.3; TIP 0,4.8
2X3 = drill 1.016 pad 1.88 octagon: 1 0,0; 2 0,2.54; 3 2.54,0; 4 2.54,2.54; 5 5.08,0; 6 5.08,2.54
2X8 = drill 1.016 pad 1.88 octagon: 1 0,0; 2 0,2.54; 3 2.54,0; 4 2.54,2.54; 5 5.08,0; 6 5.08,2.54; 7 7.62,0; 8 7.62,2.54; 9 10.16,0; 10 10.16,2.54; 11 12.7,0; 12 12.7,2.54; 13 15.24,0; 14 15.24,2.54; 15 17.78,0; 16 17.78,2.54
FIDUCIAL-1X2 = smd 1 x 1: 1 0,0
0603 = smd 0.85 x 0.7: 1 -0.9,0; 2 0.7,0
LED3MM = drill 0.813 octagon: A -1.27,0; K 1.27,0
PTC-1206 = smd 1 x 1.8: 1 -1.4,0; 2 1.4,0
SOT23-BEC = smd 1 x 1.4: B -0.95,-1.1; C 0,1.1; E 0.95,-1.1
HC49U70 = drill 0.813 round: 1 -2.413,0; 2 2.413,0
R0603 = smd 1 x 1.1: 1 -0.85,0; 2 0.85,0
ALPS_POT_VERTICAL_PS = drill 1 pad 1.88 square: P$1 -2.5,7; P$2 0,7; P$3 2.5,7 | drill 1.5 pad 2.54 octagon: P$4 -4.7,0; P$5 4.7,0
ES_100SP1T6B11M2QEH_SMALL = drill 1.5 pad 2.54 round: O -4.699,0; P 0,0; S 4.699,0
TACTILE-PTH = drill 1.016 pad 1.88 round: 1 -3.251,2.261; 2 3.251,2.261; 3 -3.251,-2.261; 4 3.251,-2.261

### Placement (x,y rotation side)
C1  19.68,98.9 0 top
C2  82.23,86.04 0 top
C3  23.5,85.72 180 top
C4  31.11,85.72 180 top
C5  35.56,85.72 0 top
C6  53.34,83.19 0 top
C7  64.77,82.55 180 top
C8  87.95,81.28 180 top
C9  40.96,80.64 180 top
C10  74.61,80.01 180 top
C11  53.34,79.69 0 top
C12  27.94,78.74 180 top
C13  67.31,78.74 180 top
C14  67.31,73.66 180 top
C15  82.23,65.09 0 top
C16  70.17,64.45 180 top
C17  83.19,62.55 90 top
C18  6.03,62.23 90 top
C19  13.34,62.23 90 top
C20  74.61,59.69 180 top
C21  66.04,56.2 90 top
C22  81.6,45.72 0 top
C23  23.5,45.09 180 top
C24  31.11,45.09 180 top
C25  35.56,45.09 0 top
C26  67.63,44.77 90 top
C27  53.34,42.55 0 top
C28  89.53,40.64 0 top
C29  40.96,40.01 180 top
C30  76.52,39.05 180 top
C31  53.34,39.05 0 top
C32  27.94,38.1 180 top
C33  64.14,36.51 180 top
C34  64.14,34.61 0 top
C35  64.14,33.02 0 top
C36  78.42,24.13 0 top
C37  36.2,22.54 270 top
C38  78.42,22.54 0 top
C39  15.56,21.59 90 top
C40  31.75,21.59 90 top
C41  61.91,19.68 0 top
C42  76.52,14.92 0 top
C43  48.9,14.29 90 top
C44  56.83,11.43 90 top
C45  48.9,11.11 270 top
C46  68.26,2.54 270 top
D1  8.57,24.45 180 top
D2  1.91,14.92 270 top
D3  1.91,6.03 90 top
IC1  76.2,83.5 270 top
IC2  29.53,82.23 270 top
IC3  46.99,81.28 270 top
IC4  66.99,76.2 270 top
IC5  66.99,71.12 270 top
IC6  76.2,63.18 270 top
IC7  66.99,52.39 0 top
IC8  78.11,42.55 270 top
IC9  29.53,41.59 270 top
IC10  46.99,40.64 270 top
IC11  62.23,40.64 90 top
IC12  62.87,27.3 270 top
IC13  23.81,20.95 180 top
IC14  MCP4822  [SO08']  80.64,18.73 270 top
IC15  65.72,11.43 90 top
J1  9.84,92.71 90 top
J2  22.86,92.71 90 top
J3  34.29,92.71 90 top
J4  75.88,92.71 90 top
J5  9.84,72.39 90 top
J6  22.86,72.39 90 top
J7  34.29,72.39 90 top
J8  75.88,72.39 90 top
J9  9.84,52.07 90 top
J10  22.86,52.07 90 top
J11  34.29,52.07 90 top
J12  75.88,52.07 90 top
J13  9.84,31.75 90 top
J14  22.86,31.75 90 top
J15  34.29,31.75 90 top
J16  75.88,31.75 90 top
J17  88.9,6.99 270 top
J18  81.28,5.08 0 bottom
J19  9.84,21.59 270 bottom
J20  56.52,26.04 270 bottom
JP1  95.89,98.42 0 top
JP2  95.89,4.45 0 top
JP3  3.17,1.91 0 top
JP4  1.91,98.42 0 top
L1  50.8,20 270 top
LED1  15.88,14.61 180 top
LED2  24.13,14.61 180 top
LED3  32.38,14.61 180 top
LED4  40.64,14.61 180 top
P1  4.13,15.24 270 top
P2  4.13,6.35 270 top
Q1  8.26,84.45 0 top
Q2  14.29,84.45 0 top
Q3  8.26,43.81 0 top
Q4  14.29,43.81 0 top
Q5  52.7,12.7 90 top
R1  13.34,98.9 0 top
R2  16.51,98.9 0 top
R3  47.31,92.71 180 top
R4  88.9,92.71 180 top
R5  70.48,85.09 180 top
R6  82.23,84.45 0 top
R7  23.5,84.14 180 top
R8  35.56,84.14 0 top
R9  5.71,83.82 270 top
R10  11.75,83.82 270 top
R11  70.48,83.5 180 top
R12  82.23,82.87 0 top
R13  23.5,82.55 0 top
R14  35.56,82.55 180 top
R15  40.96,82.23 180 top
R16  70.48,81.92 0 top
R17  82.23,81.28 180 top
R18  23.5,80.96 0 top
R19  35.56,80.96 180 top
R20  53.34,81.28 0 top
R21  5.71,80.64 90 top
R22  7.3,80.64 270 top
R23  11.75,80.64 90 top
R24  13.34,80.64 270 top
R25  23.5,79.38 0 top
R26  35.56,79.38 180 top
R27  40.96,79.06 0 top
R28  54.29,78.11 180 top
R29  47.31,72.39 180 top
R30  88.9,72.39 180 top
R31  70.17,66.04 180 top
R32  70.17,62.87 180 top
R33  81.6,62.55 90 top
R34  84.77,62.55 270 top
R35  70.17,61.28 0 top
R36  86.36,60.64 90 top
R37  87.95,60.64 90 top
R38  89.53,60.64 90 top
R39  47.31,52.07 180 top
R40  88.9,52.07 180 top
R41  72.39,44.13 180 top
R42  23.5,43.5 180 top
R43  35.56,43.5 0 top
R44  5.71,43.18 270 top
R45  11.75,43.18 270 top
R46  72.39,42.55 180 top
R47  83.82,42.23 0 top
R48  23.5,41.91 0 top
R49  35.56,41.91 180 top
R50  40.96,41.59 180 top
R51  72.39,40.96 0 top
R52  83.82,40.64 0 top
R53  23.5,40.32 0 top
R54  35.56,40.32 180 top
R55  53.34,40.64 0 top
R56  5.71,40.01 90 top
R57  7.3,40.01 270 top
R58  11.75,40.01 90 top
R59  13.34,40.01 270 top
R60  83.82,39.05 180 top
R61  23.5,38.73 0 top
R62  35.56,38.73 180 top
R63  40.96,38.42 0 top
R64  64.14,38.1 0 top
R65  54.29,37.47 180 top
R66  47.31,31.75 180 top
R67  88.9,31.75 180 top
R68  57.15,15.88 90 top
R69  19.68,15.24 90 top
R70  27.94,15.24 90 top
R71  36.2,15.24 90 top
R72  44.45,15.24 90 top
SW1  61.59,92.71 270 top
SW2  61.59,72.39 90 top
SW3  61.59,52.07 90 top
SW4  15.88,6.99 90 top
SW5  24.13,6.99 90 top
SW6  32.38,6.99 90 top
SW7  40.64,6.99 90 top
U$1  [EURORACK_TEMPLATE]  -1.59,118.11 0 top  (outside the outline)

### Tracks (layer width: path | path; a pad name or v marks a point on that pad's centre or on a via)
+3V3  (via drill 0.6)
  Top 0.254: C36.1 C38.1 IC14.1 | 16.83,48.58 18.73,46.67 18.73,40.01 | 16.83,48.58 16.19,49.21 16.19,69.53 16.51,69.85 16.51,75.56 17.78,76.83 17.78,80.64 | 50.8,21.27 53.02,19.05 54.61,19.05 56.94,16.73 R68.2 | 18.73,40.01 18.73,38.1 22.23,34.61 38.42,34.61 40.32,32.7 40.32,25.08 v40.64,24.77 | R21.2 R9.2 5.61,82.87 5.4,82.87 4.76,83.5 4.76,88.27 6.03,89.53 14.61,89.53 17.78,86.36 17.78,80.64 | R10.2 R23.2 11.64,81.6 11.11,81.6 v10.16,80.64 | 17.78,80.64 v18.41,80.64 | R56.2 R44.2 5.5,42.55 5.08,42.55 4.76,42.86 4.76,46.35 7.3,48.9 v13.34,48.9 | 11.75,40.96 R58.2 | 16.83,48.58 v17.14,48.9 | 11.75,40.96 R45.2 | 11.75,40.96 11.11,40.96 v10.16,40.01 | 18.73,40.01 v19.37,40.01
  Top 0.356: C6.1 52.39,83.29 52.39,83.82 53.02,84.45 v57.15,84.45 | 52.39,42.65 52.39,43.18 53.02,43.81 v56.2,43.81
  Top 0.406: v36.2,24.77 C37.1 36.09,23.5 35.24,23.5 34.75,23.99 C40.+ 29.7,23.99 27.94,22.23 24.45,22.23 23.81,22.86 23.81,24.08 IC13.2 | v40.64,24.77 40.64,23.81 41.59,22.86 50.8,22.86 | 50.8,22.86 J20.2 v55.88,27.94 57.15,27.94 58.42,26.67 58.42,20.64 59.37,19.68 | 59.37,38.1 v59.37,34.61 C34.1 C35.1 63.28,31.96 64.14,31.11 IC12.14 | 59.37,38.1 v59.37,43.81 v59.37,54.61 59.37,80.01 | 59.37,80.01 v59.37,84.45 59.37,88.9 60.64,90.17 62.23,90.17 63.5,91.44 63.5,95.25 61.59,97.16 SW1.O | C6.1 IC3.8 | IC10.8 C27.1 52.39,42.65 | 50.8,22.86 50.8,21.27 L1.1 | 59.37,38.1 R64.1 | v67.31,55.24 66.14,55.24 C21.1 IC7.5 | IC5.5 68.29,73.53 C14.1 68.16,73.76 67.31,74.61 67.31,76.83 67.63,77.15 IC4.5 68.29,78.61 C13.1 68.26,78.84 68.26,79.06 67.31,80.01 59.37,80.01 | C46.1 68.48,3.17 | C38.1 v76.2,22.54 75.56,21.91 75.56,15.03 C42.1 75.56,14.82 75.56,14.29 74.31,13.03 IC15.19 71.51,13.02 | IC15.9 68.12,3.53 C46.1 | 59.37,19.68 C41.1 61.28,19.47 61.28,19.05 61.91,18.41 63.18,18.41 63.32,18.27 IC15.31 | v69.22,7.94 59.37,17.78 59.37,19.68 | 83.5,4.45 v83.5,15.24 | 83.5,4.45 81.6,2.54 v70.17,2.54 69.53,2.54 68.68,3.39 C46.1 | 83.5,4.45 v83.5,2.86
  Bottom 0.254: v18.41,80.64 v10.16,80.64 | v17.14,48.9 v13.34,48.9 | v19.37,40.01 v10.16,40.01
  Bottom 0.356: v59.37,84.45 v57.15,84.45 | v59.37,43.81 v56.2,43.81
  Bottom 0.406: v36.2,24.77 v40.64,24.77 | v55.88,27.94 59.37,31.43 v59.37,34.61 | v67.31,55.24 64.45,55.24 63.82,54.61 v59.37,54.61 | v83.5,15.24 v76.2,22.54 | v70.17,2.54 70.17,6.99 v69.22,7.94 | v83.5,2.86 J18.1
+5V
  Top 0.406: J19.5 J19.6 6.35,16.51 5.4,17.46 5.4,23.81 6.03,24.45 D1.A
ADC_MISO
  Top 0.254: IC12.10 64.14,26.04 63.18,25.08 63.18,22.54 63.82,21.91 65.72,21.91 67.32,20.31 IC15.26
ADC_MOSI
  Top 0.254: IC12.9 64.14,24.77 63.82,24.45 63.82,22.86 64.14,22.54 66.04,22.54 68.12,20.46 IC15.25
ADC_SCK
  Top 0.254: 64.45,27.3 IC12.11 63.82,27.3 62.55,26.04 62.55,22.23 63.5,21.27 65.41,21.27 66.52,20.16 IC15.27
ADC_SS
  Top 0.254: IC12.8 66.67,23.5 69.72,20.45 IC15.23
AREF
  Top 0.254: IC12.13 66.67,29.84 66.99,30.16 66.99,35.24 65.72,36.51 C33.1 R64.2 64.77,38.31 64.77,39.05 64.13,39.69 IC11.1
CH1
  Top 0.254: IC12.1 59.05,31.11 57.78,32.38 57.78,79.38 55.88,81.28 R20.2 | R20.2 C11.2 | IC3.7 50.8,81.92 51.12,82.23 53.98,82.23 54.19,82.02 R20.2
CH2
  Top 0.254: IC12.2 59.05,29.84 57.15,31.75 57.15,75.25 55.56,76.83 49.85,76.83 47.94,78.74 47.94,80.96 45.72,83.19 IC3.1 40.32,83.19 40.11,82.97 R15.2 C9.2
CH3
  Top 0.254: R55.2 54.19,41.06 53.66,41.59 51.75,41.59 51.44,41.27 IC10.7 | IC12.3 59.05,28.57 56.52,31.11 56.52,39.05 54.93,40.64 R55.2 | R55.2 C31.2
CH4
  Top 0.254: IC12.4 59.05,27.3 55.88,30.48 55.88,33.66 53.34,36.2 49.85,36.2 47.94,38.1 47.94,40.32 45.72,42.55 IC10.1 40.32,42.55 40.11,42.33 R50.2 C29.2
CHANNEL1
  Top 0.254: IC4.4 68.9,75.25 69.22,75.56 69.22,79.69 67.94,80.96 64.14,80.96 62.72,82.38 C7.+
CHANNEL1_BUFFERED
  Top 0.254: R11.2 R5.2 69.53,85.19 69.53,89.53 71.08,91.08 J4.TIP
CHANNEL1_RETURN
  Top 0.254: R4.P$2 88.9,85.09 90.17,83.82 91.12,83.82 92.71,82.23 92.71,79.69 91.12,78.11 91.12,71.44 93.34,69.22 93.34,61.59 91.54,59.79 R38.1
CHANNEL2
  Top 0.254: IC5.4 68.58,70.17 69.22,70.8 69.22,73.98 70.17,74.93 77.79,74.93 79.38,76.52 82.55,76.52 85.9,79.86 C8.+ 85.9,81.14
CHANNEL2_BUFFERED
  Top 0.254: R6.2 R12.2 83.4,83.19 90.81,83.19 92.08,81.92 92.08,80.01 91.44,79.38 86.36,79.38 82.87,75.88 79.69,75.88 78.11,74.3 71.75,74.3 71.08,73.62 J8.TIP
CHANNEL2_RETURN
  Top 0.254: R34.1 84.88,63.5 87.63,63.5 88.9,64.77 R30.P$2
CHANNEL3
  Top 0.254: C26.+ 69.22,48.41 69.22,53.02 68.55,53.69 IC7.4
CHANNEL3_BUFFERED
  Top 0.254: R46.2 R41.2 71.75,44.35 71.75,50.16 71.08,50.84 J12.TIP
CHANNEL3_RETURN
  Top 0.254: R40.P$2 88.9,51.75 87.31,53.34 87.31,58.1 86.36,59.05 R36.1
CHANNEL4
  Top 0.254: IC14.8 83.5,20.85 83.5,21.91 81.92,23.5 81.92,25.4 77.79,29.53 77.79,33.66 78.74,34.61 86.68,34.61 91.58,39.52 C28.+
CHANNEL4_BUFFERED
  Top 0.254: R52.2 R47.2 88.58,42.23 89.53,41.27 89.53,38.42 86.36,35.24 78.42,35.24 77.47,34.29 72.07,34.29 71.12,33.34 71.12,31.79 J16.TIP
CHANNEL4_RETURN
  Top 0.254: R67.P$2 88.9,32.7 94.61,38.42 94.61,46.99 87.95,53.66 R37.1
COARSE1
  Top 0.254: R3.P$2 47.31,86.68 46.51,87.47 40.8,87.47 39.05,89.22 39.05,94.61 38.1,95.57 17.78,95.57 16.51,94.3 16.51,91.12 19.37,88.27 19.37,81.92 21.91,79.38 R25.1
COARSE2
  Top 0.254: R29.P$2 47.31,73.03 43.18,77.15 40.32,77.15 38.1,79.38 38.1,81.28 36.83,82.55 R14.1
COARSE3
  Top 0.254: R39.P$2 47.31,46.2 46.67,46.83 40.48,46.83 39.21,48.1 39.21,53.5 38.1,54.61 17.78,54.61 16.83,53.66 16.83,50.48 19.37,47.94 19.37,41.27 21.91,38.73 R61.1
COARSE4
  Top 0.254: R49.1 37.15,41.91 38.1,40.96 38.1,38.73 40.32,36.51 43.18,36.51 47.31,32.38 R66.P$2
CV1  (via drill 0.6)
  Top 0.254: R18.1 21.91,80.96 v21.27,81.6 20,82.87 20,88.58 18.06,90.53 J2.TIP
  Bottom 0.254: J6.SW 25.4,72.39 21.27,76.52 v21.27,81.6
CV2  (via drill 0.6)
  Top 0.254: R26.1 36.51,79.27 36.51,76.2 34.92,74.61 25.08,74.61 22.86,72.39 | 22.86,72.39 J6.TIP | v26.04,59.05 26.04,69.22 22.86,72.39
  Bottom 0.254: J10.SW 26.04,52.2 v26.04,59.05
CV3  (via drill 0.6)
  Top 0.254: R53.1 21.91,40.32 v21.27,40.96 20,42.23 20,48.26 18.06,50.2 J10.TIP | v23.5,33.02 24.77,31.75 26.04,31.75 26.16,31.62 J14.SW
  Bottom 0.254: v21.27,40.96 21.27,35.24 v23.5,33.02
CV4  (via drill 0.6)
  Top 0.254: R62.1 36.51,38.63 36.51,38.42 36.83,38.1 v36.83,37.15
  Bottom 0.254: J14.TIP 18.1,31.71 18.1,30.8 19.37,29.53 26.99,29.53 27.62,30.16 27.62,33.02 28.57,33.97 34.92,33.97 36.83,35.88 v36.83,37.15
DAC_MOSI
  Top 0.254: IC15.17 76.83,11.43 78.74,13.34 78.74,16.51 78.42,16.83 IC14.4
DAC_SCK
  Top 0.254: 71.53,9.84 IC15.15 73.01,9.83 73.34,10.16 77.47,10.16 80.01,12.7 80.01,17.46 79.38,18.1 IC14.3 77.15,18.1
DAC_SS
  Top 0.203: 79.06,17.46 76.2,17.46
  Top 0.229: 79.38,17.14 79.06,17.46 | 76.2,17.46 76.2,19.37
  Top 0.254: 79.38,17.14 79.38,13.02 77.15,10.79 73.03,10.79 72.86,10.63 IC15.16 | 76.2,19.37 IC14.2
FM1
  Top 0.254: J3.TIP 29.49,92.36 26.99,89.85 21.59,89.85 20.64,88.9 20.64,83.5 21.59,82.55 R13.1
FM2
  Top 0.254: R19.1 37.15,80.96 37.47,80.64 37.47,75.56 34.29,72.39 J7.TIP
FM3
  Top 0.254: R48.1 21.91,41.91 21.59,42.23 21.59,45.72 20.64,46.67 20.64,47.94 21.91,49.21 26.99,49.21 29.49,51.72 J11.TIP
FM4  (via drill 0.6)
  Top 0.254: R54.1 37.15,40.32 37.47,40.01 37.47,38.42 37.78,38.1 v37.78,35.88 | v34.92,33.02 34.61,33.34 29.84,33.34 29.49,32.98 J15.TIP
  Bottom 0.254: v34.92,33.02 v37.78,35.88
GATE1
  Top 0.254: IC15.40 58.57,10.63 55.88,7.94 48.26,7.94 47.31,8.89 47.31,17.78 44.77,20.32 41.91,20.32 39.69,22.54 39.69,32.38 38.1,33.97 21.91,33.97 18.1,37.78 18.1,46.35 15.56,48.9 15.56,69.85 15.88,70.17 15.88,75.88 17.14,77.15 17.14,85.41 15.88,86.68 12.06,86.68 11.11,85.72 8.43,85.72 Q1.C 8.09,85.72 6.03,85.72 5.71,85.41 R9.1
GATE1_IN
  Top 0.254: R22.2 7.3,78.74 6.99,78.42 5.08,78.42 | 5.08,78.42 4.13,79.38 4.13,89.85 5.04,90.77 J1.TIP | J5.SW 11.11,72.39 5.08,78.42
GATE1_LED
  Top 0.254: LED4.A 43.4,16.09 R72.2
GATE2
  Top 0.254: IC15.41 58.73,9.83 56.2,7.3 47.94,7.3 46.67,8.57 46.67,17.46 44.45,19.68 41.59,19.68 39.05,22.23 39.05,27.62 36.83,29.84 30.48,29.84 30.16,29.53 25.4,29.53 17.46,37.47 17.46,46.04 14.92,48.58 14.92,70.17 15.24,70.48 15.24,76.2 16.51,77.47 16.51,85.09 16.05,85.56 Q2.C 14.12,85.72 12.06,85.72 11.75,85.41 R10.1
GATE2_IN
  Top 0.254: R24.2 14.61,78.53 14.61,70.8 13.97,70.17 7.3,70.17 | 7.3,70.17 6.03,70.17 5.04,71.16 J5.TIP | J9.SW 10.48,52.07 7.94,54.61 7.94,60.01 9.84,61.91 9.84,64.77 7.3,67.31 7.3,70.17
GATE2_LED
  Top 0.254: LED3.A 35.14,16.09 R71.2
GATE3
  Top 0.254: 59.78,8.89 IC15.42 58.88,9.03 56.52,6.67 47.62,6.67 46.04,8.26 46.04,17.14 44.13,19.05 41.27,19.05 38.42,21.91 38.42,27.3 36.51,29.21 30.8,29.21 30.48,28.89 25.08,28.89 16.83,37.15 16.83,45.4 16.19,46.04 11.75,46.04 10.62,44.91 Q3.C 8.09,45.09 6.03,45.09 5.71,44.77 R44.1
GATE3_IN
  Top 0.254: J9.TIP 5.08,52.03 5.08,49.53 4.13,48.58 4.13,38.73 5.08,37.78 | 5.08,37.78 6.99,37.78 7.3,38.1 R57.2 | J13.SW 11.11,31.75 5.08,37.78
GATE3_LED
  Top 0.254: LED2.A 26.89,16.09 R70.2
GATE4
  Top 0.254: IC15.43 59.03,8.23 56.83,6.03 47.31,6.03 45.4,7.94 45.4,16.83 43.81,18.41 40.96,18.41 37.78,21.59 37.78,26.99 36.2,28.57 31.11,28.57 30.8,28.26 24.77,28.26 16.19,36.83 16.19,44.45 15.73,44.91 Q4.C 14.12,45.09 12.06,45.09 11.75,44.77 R45.1
GATE4_IN
  Top 0.254: R59.2 13.34,34.29 14.61,33.02 14.61,30.16 13.97,29.53 6.35,29.53 5.04,30.84 J13.TIP
GATE4_LED
  Top 0.254: LED1.A 18.63,16.09 R69.2
GND  (via drill 0.6)
  other vias: 58.1,12.38 64.45,19.37 76.83,13.34 66.67,1.59 13.34,76.2 15.24,40.96 30.16,87.31 30.16,46.67 43.81,78.11 28.89,77.15 29.21,82.23 29.53,41.59 28.89,36.51 43.81,37.47 50.16,78.11 50.16,37.47 55.88,42.23 56.2,82.55 60.33,22.23 63.18,28.57 50.8,12.7 7.94,62.23 12.38,62.23 61.59,36.51 75.88,24.45 62.23,43.18 67.31,49.53 67.63,57.15 65.72,68.58 64.77,73.66 65.09,78.74 76.2,83.5 76.2,61.28 78.11,42.55 79.38,39.05 83.19,67.94 83.19,87.63 85.72,19.68 63.82,9.53 66.36,8.26 67.63,13.34 30.48,16.51 38.73,16.51 13.97,16.51 17.46,19.05 33.66,19.05 27.94,25.08 83.82,45.72 91.44,62.87 1.27,101.6 1.27,1.27 1.27,91.44 1.27,71.12 1.27,50.8 1.27,40.64 1.27,30.48 1.27,10.16 21.59,1.27 71.44,1.27 96.52,1.27 96.52,10.16 96.52,20.32 96.52,30.48 96.52,40.64 96.52,50.8 96.52,60.96 96.52,71.12 96.52,81.28 96.52,91.44 96.52,101.6 85.09,101.6 74.93,101.6 15.88,96.84 58.42,97.79 88.9,97.79 38.1,59.69 38.1,69.85 88.9,8.89 88.9,19.05 88.9,90.17 66.04,90.17 40.64,90.17 48.9,20.95 53.34,64.77 53.34,54.61 61.59,33.02 71.75,6.03 76.2,64.77 15.24,81.6 8.89,40.96 1.27,60.96 32.07,50.8 26.35,47.62 26.04,76.2 32.07,76.2 78.11,59.69 78.11,80.01 72.07,68.58 74.61,69.85 72.07,77.15 65.09,14.61 7.62,73.66 22.86,52.07 7.62,33.02
  pour Bottom: 0,102.87 0,0 97.79,0 97.79,102.87
  pour Top (isolate 0.203): 0,102.87 0,0 97.79,0 97.79,102.87
MIDI_IN
  Top 0.254: IC15.12 74.17,7.43 75.25,6.35 77.47,6.35 J18.3
N$1
  Top 0.254: R21.1 7.3,81.38 R22.1 Q1.B
N$2
  Top 0.254: Q2.B R24.1 13.34,81.38 R23.1
N$3
  Top 0.254: R56.1 7.3,40.74 R57.1 Q3.B
N$4
  Top 0.254: R30.P$1 91.4,69.57 85.72,75.25 80.64,75.25 79.06,73.66 79.06,72.52 J8.SW
N$5
  Top 0.254: IC15.44 59.18,7.43 57.15,5.4 46.99,5.4 44.77,7.62 44.77,13.02 44.45,13.34 R72.1
N$6
  Top 0.254: R71.1 36.2,13.65 36.51,13.34 39.69,13.34 41.27,11.75 41.27,7.62 41.91,6.99 44.45,6.99 46.67,4.76 60.64,4.76 61.51,5.63 IC15.1
N$7
  Top 0.254: R70.1 27.94,13.65 28.89,12.7 39.37,12.7 40.64,11.43 40.64,6.99 41.27,6.35 44.13,6.35 46.35,4.13 60.96,4.13 | 60.96,4.13 60.98,4.1 | 60.96,4.13 61.91,4.13 62.52,4.74 IC15.2
N$8
  Top 0.254: R69.1 19.68,13.65 21.27,12.06 39.05,12.06 40.01,11.11 40.01,6.67 40.96,5.71 43.81,5.71 46.04,3.49 62.23,3.49 63.32,4.58 IC15.3
N$9
  Top 0.254: C5.1 R8.1 R14.2 R19.2 | R19.2 R26.2 | IC2.6 33.34,81.6 33.97,80.96 R19.2
N$10
  Top 0.254: IC2.7 33.34,82.87 33.66,83.19 33.66,86.36 33.97,86.68 36.2,86.68 36.41,86.46 C5.2 R8.2 37.15,84.14 38.73,82.55 38.73,80.01 39.69,79.06 R27.1
N$11
  Top 0.254: IC3.2 42.86,81.92 42.55,82.23 R15.1 C9.1 R27.2
N$12  (via drill 0.6)
  Top 0.254: R7.2 C3.2 22.64,86.46 22.86,86.68 26.67,86.68 | IC2.1 26.67,84.39 26.67,86.68 | 26.67,86.68 29.84,89.85 36.83,89.85 37.47,89.22 37.47,86.04 39.53,83.98 51.28,83.98 52.7,85.41 v54.93,85.41 | v56.83,78.11 R28.1
  Bottom 0.254: v56.83,78.11 54.93,80.01 v54.93,85.41
N$13
  Top 0.254: R48.2 R53.2 R61.2 | IC9.2 25.4,42.23 25.08,41.91 R48.2 | R48.2 R42.1 C23.1
N$14  (via drill 0.6)
  Top 0.254: IC9.1 26.99,43.56 26.99,46.04 | 26.99,46.04 22.86,46.04 22.64,45.82 C23.2 R42.2 | 26.99,46.04 30.16,49.21 36.83,49.21 37.47,48.58 37.47,45.09 39.21,43.34 51.59,43.34 53.02,44.77 v54.61,44.77 | R65.1 55.24,37.36 v55.24,35.88
  Bottom 0.254: v54.61,44.77 54.61,36.51 v55.24,35.88
N$15
  Top 0.254: IC10.6 50.8,40.01 51.44,40.64 R55.1 C31.1 52.49,38 53.02,37.47 R65.2
N$16
  Top 0.254: C25.1 R43.1 R49.2 R54.2 | IC9.6 33.66,40.96 34.29,40.32 R54.2 | R54.2 R62.2
N$17
  Top 0.254: IC9.7 33.34,42.23 33.66,42.55 33.66,45.72 33.97,46.04 36.2,46.04 36.41,45.82 C25.2 R43.2 37.15,43.5 38.73,41.91 38.73,39.05 39.37,38.42 R63.1
N$18
  Top 0.254: IC10.2 42.86,41.27 42.55,41.59 R50.1 C29.1 R63.2
N$19
  Top 0.254: 71.66,8.89 IC15.14 73.17,9.03 73.66,9.53 77.79,9.53 80.64,12.38 80.64,24.77 79.69,25.72 71.44,25.72 68.9,28.26 68.9,37.47 65.09,41.27 65.09,43.81 64.45,44.45 64.45,71.44 65.08,72.07 IC5.1
N$20
  Top 0.254: C7.- 67.14,82.23 67.45,82.55 68.26,82.55 68.9,81.92 R16.1
N$21  (via drill 0.6)
  Top 0.254: v66.99,52.39 IC7.2
  Bottom 0.254: v66.99,52.39 61.91,52.39 SW3.P
N$22
  Top 0.254: R16.2 R11.1 72.07,83.5 72.71,84.14 IC1.2
N$23
  Top 0.254: R5.1 71.65,85.41 IC1.1
N$24  (via drill 0.6)
  Top 0.254: v66.99,71.12 IC5.2
  Bottom 0.254: v66.99,71.12 62.87,71.12 SW2.P
N$25
  Top 0.254: R17.1 83.19,81.28 84.45,82.55 89.53,82.55 90,82.09 C8.-
N$26
  Top 0.254: R17.2 R12.1 IC1.6
N$27
  Top 0.254: IC1.7 80.01,84.14 80.33,84.45 R6.1
N$28
  Top 0.254: R51.1 69.22,40.96 67.63,42.55 C26.-
N$29
  Top 0.254: IC3.6 50.8,80.64 51.44,81.28 R20.1 C11.1 52.39,79.59 52.39,78.74 53.02,78.11 R28.2
N$30
  Top 0.254: R51.2 R46.1 73.56,42.86 73.98,42.86 74.3,43.18 IC8.2
N$31
  Top 0.254: R41.1 73.56,44.45 IC8.1
N$32
  Top 0.254: R60.1 86.04,39.05 87.48,40.49 C28.-
N$33
  Top 0.254: R60.2 R52.1 81.7,41.91 IC8.6
N$34
  Top 0.254: R47.1 82.02,43.18 IC8.7
N$35
  Top 0.254: IC6.6 80.01,62.55 80.86,61.7 R33.1 C17.1 R34.2 84.98,61.49 R36.2 R37.2 R38.2
N$36
  Top 0.254: IC6.2 72.39,63.82 71.75,64.45 C16.1 R32.1 R35.2
N$37
  Top 0.254: IC6.1 72.39,65.09 71.44,66.04 R31.1 69.43,64.45 C16.2
N$38
  Top 0.406: D1.C 11.43,24.45 11.89,23.99 C39.+ 15.67,24.11 IC13.3
N$39  (via drill 0.6)
  Top 0.406: v55.56,10.16 55.98,10.58 C44.1 56.94,10.48 57.47,10.48 58.42,11.43 IC15.39 | v55.56,15.24 55.56,16.51 54.29,17.78 51.44,17.78 50.8,18.41 L1.2
  Bottom 0.406: v55.56,10.16 v55.56,15.24
N$40
  Top 0.254: J4.SW 80.64,92.71 84.77,88.58 90.17,88.58 91.4,87.35 R4.P$1
N$41
  Top 0.254: IC15.10 68.9,5.61 68.9,4.76 69.85,3.81 70.8,3.81 71.44,3.17 81.28,3.17 82.87,4.76 82.87,8.57 81.28,10.16 81.28,25.08 77.79,28.57 71.12,28.57 69.53,30.16 69.53,37.78 65.72,41.59 65.72,50.16 66.04,50.48 IC7.1
N$42
  Top 0.254: C17.2 R33.2 80.43,63.4 80.01,63.82 IC6.7 77.15,63.82 75.25,61.91 72.23,61.91 72.07,61.75 72.07,60.64 71.75,60.33 69.85,60.33 69.32,60.86 R35.1
N$43
  Top 0.254: J12.SW 78.74,51.63 78.74,44.45 79.38,43.81 84.45,43.81 84.77,43.5 90.81,43.5 91.4,44.09 R40.P$1
N$44
  Top 0.254: J16.SW 79.18,29.09 82.55,25.72 82.55,23.81 83.5,22.86 90.81,22.86 91.4,23.45 R67.P$1
N$45
  Top 0.254: C3.1 R7.1 R13.2 | IC2.2 25.4,82.87 25.08,82.55 R13.2 | R13.2 R18.2 R25.2
N$46  (via drill 0.6)
  Top 0.254: R1.2 R2.1 15.72,98.9 15.72,98.27 16.19,97.79 18.26,97.79 18.84,98.37 C1.1 18.84,98 v19.68,97.16
  Bottom 0.254: v19.68,97.16 24.13,92.71 J2.SW
N$47
  Top 0.406: P1.2 4.26,13.97 J19.8 J19.7
N$48
  Top 0.254: 71.66,13.97 IC15.20 72.89,13.83 73.34,14.29 73.34,22.86 68.26,27.94 68.26,37.15 64.45,40.96 64.45,43.18 63.82,43.81 63.82,56.83 | 63.82,74.87 63.82,74.93 65.09,76.2 IC4.2 | 63.82,74.87 SW2.S | 63.82,56.83 63.82,74.87 | SW3.S 61.66,56.83 63.82,56.83
N$49
  Top 0.406: P2.2 4.13,4.45 4.76,3.81 J19.16 J19.15
N$50  (via drill 0.6)
  Top 0.254: v95.25,66.67 95.25,30.48 93.7,28.93 J17.TIP | v88.9,69.22 80.96,69.22 78.11,66.36 72.71,66.36 72.07,66.99 69.85,66.99 69.53,66.67 69.53,66.25 R31.2 68.58,66.04 68.26,65.72 68.26,63.18 68.58,62.87 R32.2
  Bottom 0.254: v95.25,66.67 92.71,69.22 v88.9,69.22
N$82
  Top 0.254: IC15.37 59.91,13.02 58.74,13.02 58.42,13.34 54.61,13.34 52.7,11.43 Q5.1 48.92,10.29 C45.2
N$83
  Top 0.254: IC15.36 58.88,13.83 58.74,13.97 53.98,13.97 52.83,15.11 Q5.2 52.68,15.14 C43.2
N$40000
  Top 0.254: R58.1 13.34,40.74 R59.1 Q4.B
NES_TRIANGLE_CLK  (via drill 0.6)
  Top 0.254: v68.9,11.43 68.92,11.46 IC15.24
  Bottom 0.254: J18.4 77.47,8.89 71.44,8.89 v68.9,11.43
PDICLK
  Top 0.254: 59.9,14.61 IC15.35 58.4,14.63 58.1,14.92 | J20.5 56.52,20.32 58.1,18.73 58.1,14.92 | R68.1 57.25,14.92 58.1,14.92
PDIDATA
  Top 0.254: 60.01,15.52 IC15.34 59.18,15.43 58.74,15.88 58.74,19.05 57.78,20 57.78,24.77 J20.1
SW1
  Top 0.254: IC15.4 64.12,4.43 62.55,2.86 45.72,2.86 43.5,5.08 39.69,5.08 38.38,3.77 SW7.1 SW7.2
SW2
  Top 0.254: IC15.5 64.92,4.28 62.87,2.22 31.43,2.22 30.12,3.53 SW6.1 SW6.2
SW3
  Top 0.254: IC15.6 65.72,4.13 63.18,1.59 23.81,1.59 21.87,3.53 SW5.1 SW5.2
SW4
  Top 0.254: IC15.7 66.52,3.98 63.5,0.95 23.5,0.95 22.23,2.22 14.92,2.22 13.65,3.49 13.61,3.49 SW4.1 SW4.2
SW_MIDI_LEARN
  Top 0.254: IC15.11 70.25,5.63 72.07,3.81 79.38,3.81 80.01,4.45 80.01,5.71 81.28,6.99 J18.2
SW_MIDI_MODE
  Top 0.254: IC15.13 75.59,8.23 J18.6
SYNC_SWITCH
  Top 0.254: IC15.28 65.72,20 65.09,20.64 63.18,20.64 61.91,21.91 61.91,31.75 61.59,32.07 59.69,32.07 58.42,33.34 58.42,89.53 SW1.P
VCC  (via drill 0.6)
  Top 0.254: 17.14,100.01 17.14,99.06 | 17.14,99.06 17.14,98.96 | R2.2 17.2,99.06 17.14,99.06
  Top 0.406: 48.58,100.01 v32.07,100.01 17.14,100.01 8.57,100.01 3.49,94.93 v3.49,64.77 3.49,24.77 4.13,24.13 P1.1 2.09,16.64 D2.C | 48.58,100.01 48.58,87.95 49.81,86.72 R3.P$1 | v48.58,75.88 48.58,67.63 49.81,66.4 R29.P$1 49.81,64.41 48.58,63.18 48.58,47.31 49.81,46.08 R39.P$1 | v48.58,35.24 48.58,26.99 49.81,25.76 R66.P$1 | 32.07,84.2 IC2.8 31.96,84.3 C4.1 32.07,85.83 v32.07,87 | v30.8,69.53 29.53,68.26 29.53,57.15 v30.8,55.88 | IC9.8 31.96,43.66 C24.1 31.75,45.3 v31.75,46.67 | 48.58,100.01 67.63,100.01 77.79,89.85 78.42,89.85 v80.64,87.63 81.38,86.89 C2.1 80.64,86.04 80.01,85.41 IC1.8 | v80.64,59.37 80.64,46.35 80.75,46.25 C22.1 80.75,44.49 IC8.8 | v8.26,64.77 6.67,64.77 6.53,64.63 C18.+ | IC6.8 C15.1 81.38,66.89 v80.64,67.63
  Bottom 0.406: v48.58,75.88 48.58,84.14 49.81,85.37 R3.P$1 | v48.58,35.24 48.58,43.5 49.81,44.73 R39.P$1 | v32.07,100.01 v32.07,87 30.8,85.72 v30.8,69.53 | v3.49,64.77 v8.26,64.77 | v80.64,87.63 v80.64,67.63 v80.64,59.37 | v31.75,46.67 30.8,47.62 v30.8,55.88
VEE  (via drill 0.6)
  Top 0.406: v73.34,96.04 68.26,101.12 v27.62,101.12 8.1,101.12 2.38,95.41 v2.38,59.69 2.38,20.16 v2.54,20 | IC2.4 26.93,78.9 C12.2 26.77,78.42 v25.72,78.42 | v27.62,69.22 28.57,68.26 28.57,56.83 v27.62,55.88 | v25.72,38.1 C32.2 27.09,39.52 IC9.4 | C19.- 13.2,59.69 v10.16,59.69 | 75.5,39.22 C30.2 | IC1.4 73.6,80.17 C10.2 v72.39,80.01 | 75.5,39.22 75.34,39.05 v74.3,39.05 | v72.07,59.37 73.34,59.37 | 73.34,59.37 73.34,45.72 v72.71,45.72 | 75.5,39.22 IC8.4 | IC6.4 73.6,59.85 C20.2 73.66,59.69 73.34,59.37 | D3.A 2.09,7.75 P2.1 4.13,8.89 v3.17,9.84
  Bottom 0.356: 26.04,38.1 v25.72,38.1
  Bottom 0.406: v27.62,101.12 27.62,78.42 | 27.62,78.42 v25.72,78.42 | 27.62,78.42 v27.62,69.22 | v27.62,55.88 27.62,39.69 26.04,38.1 | v2.38,59.69 v10.16,59.69 | 73.34,80.01 v72.39,80.01 | v73.34,96.04 73.34,80.01 | v74.3,39.05 73.34,40.01 73.34,45.72 v72.71,45.72 | 73.34,80.01 73.34,60.64 v72.07,59.37 | v3.17,9.84 2.54,10.48 v2.54,20

### Text on the board
bPlace: PDI | Expander | Red stripe
tNames: Edges | cc-by-sa Olivier Gillet, 2012. v0.1
bNames: Edges | cc-by-sa Olivier Gillet, 2012. v0.1 | +5V | +12V | GND | GND | GND | -12V